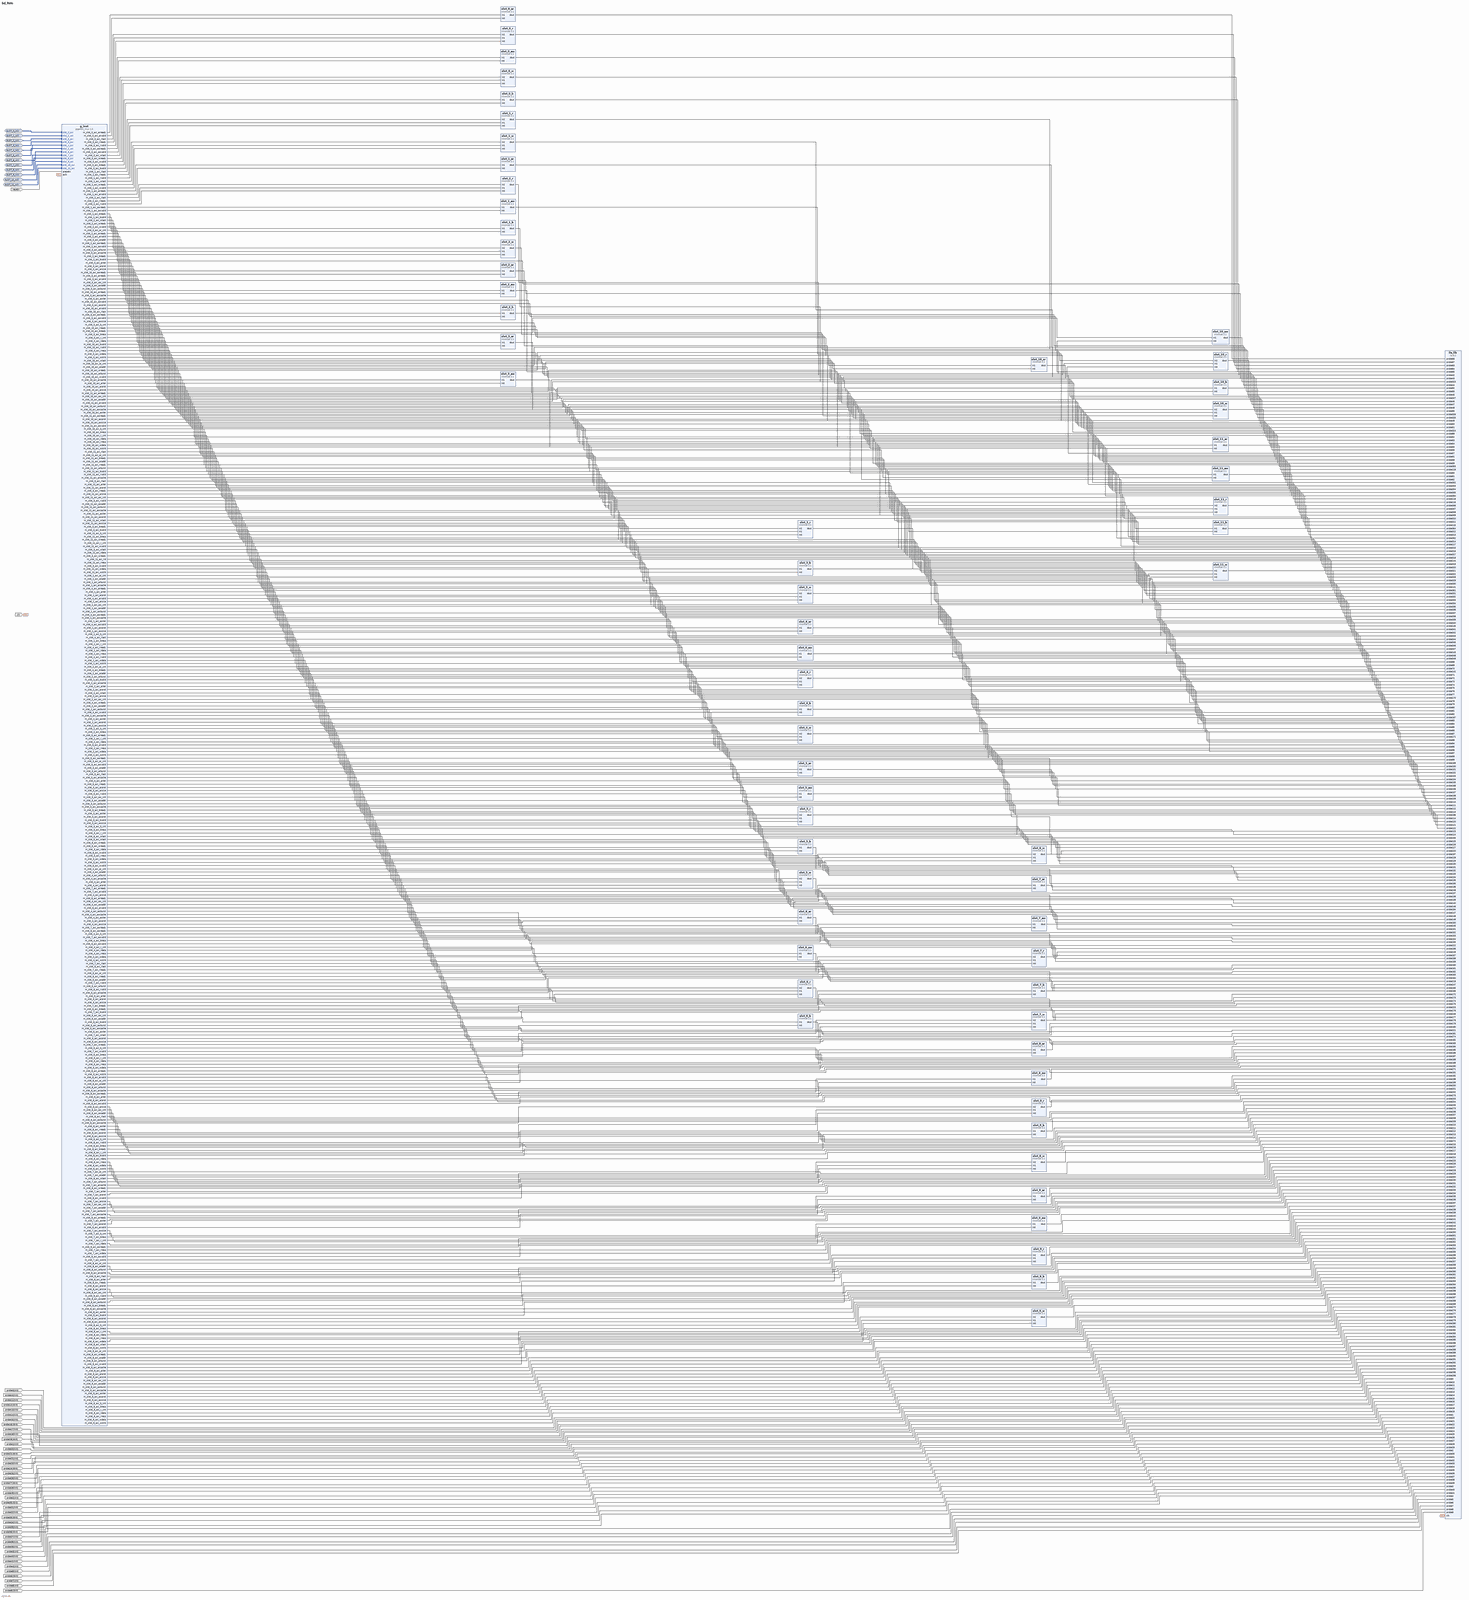
[diagram p0: block diagram of the top level, whole]
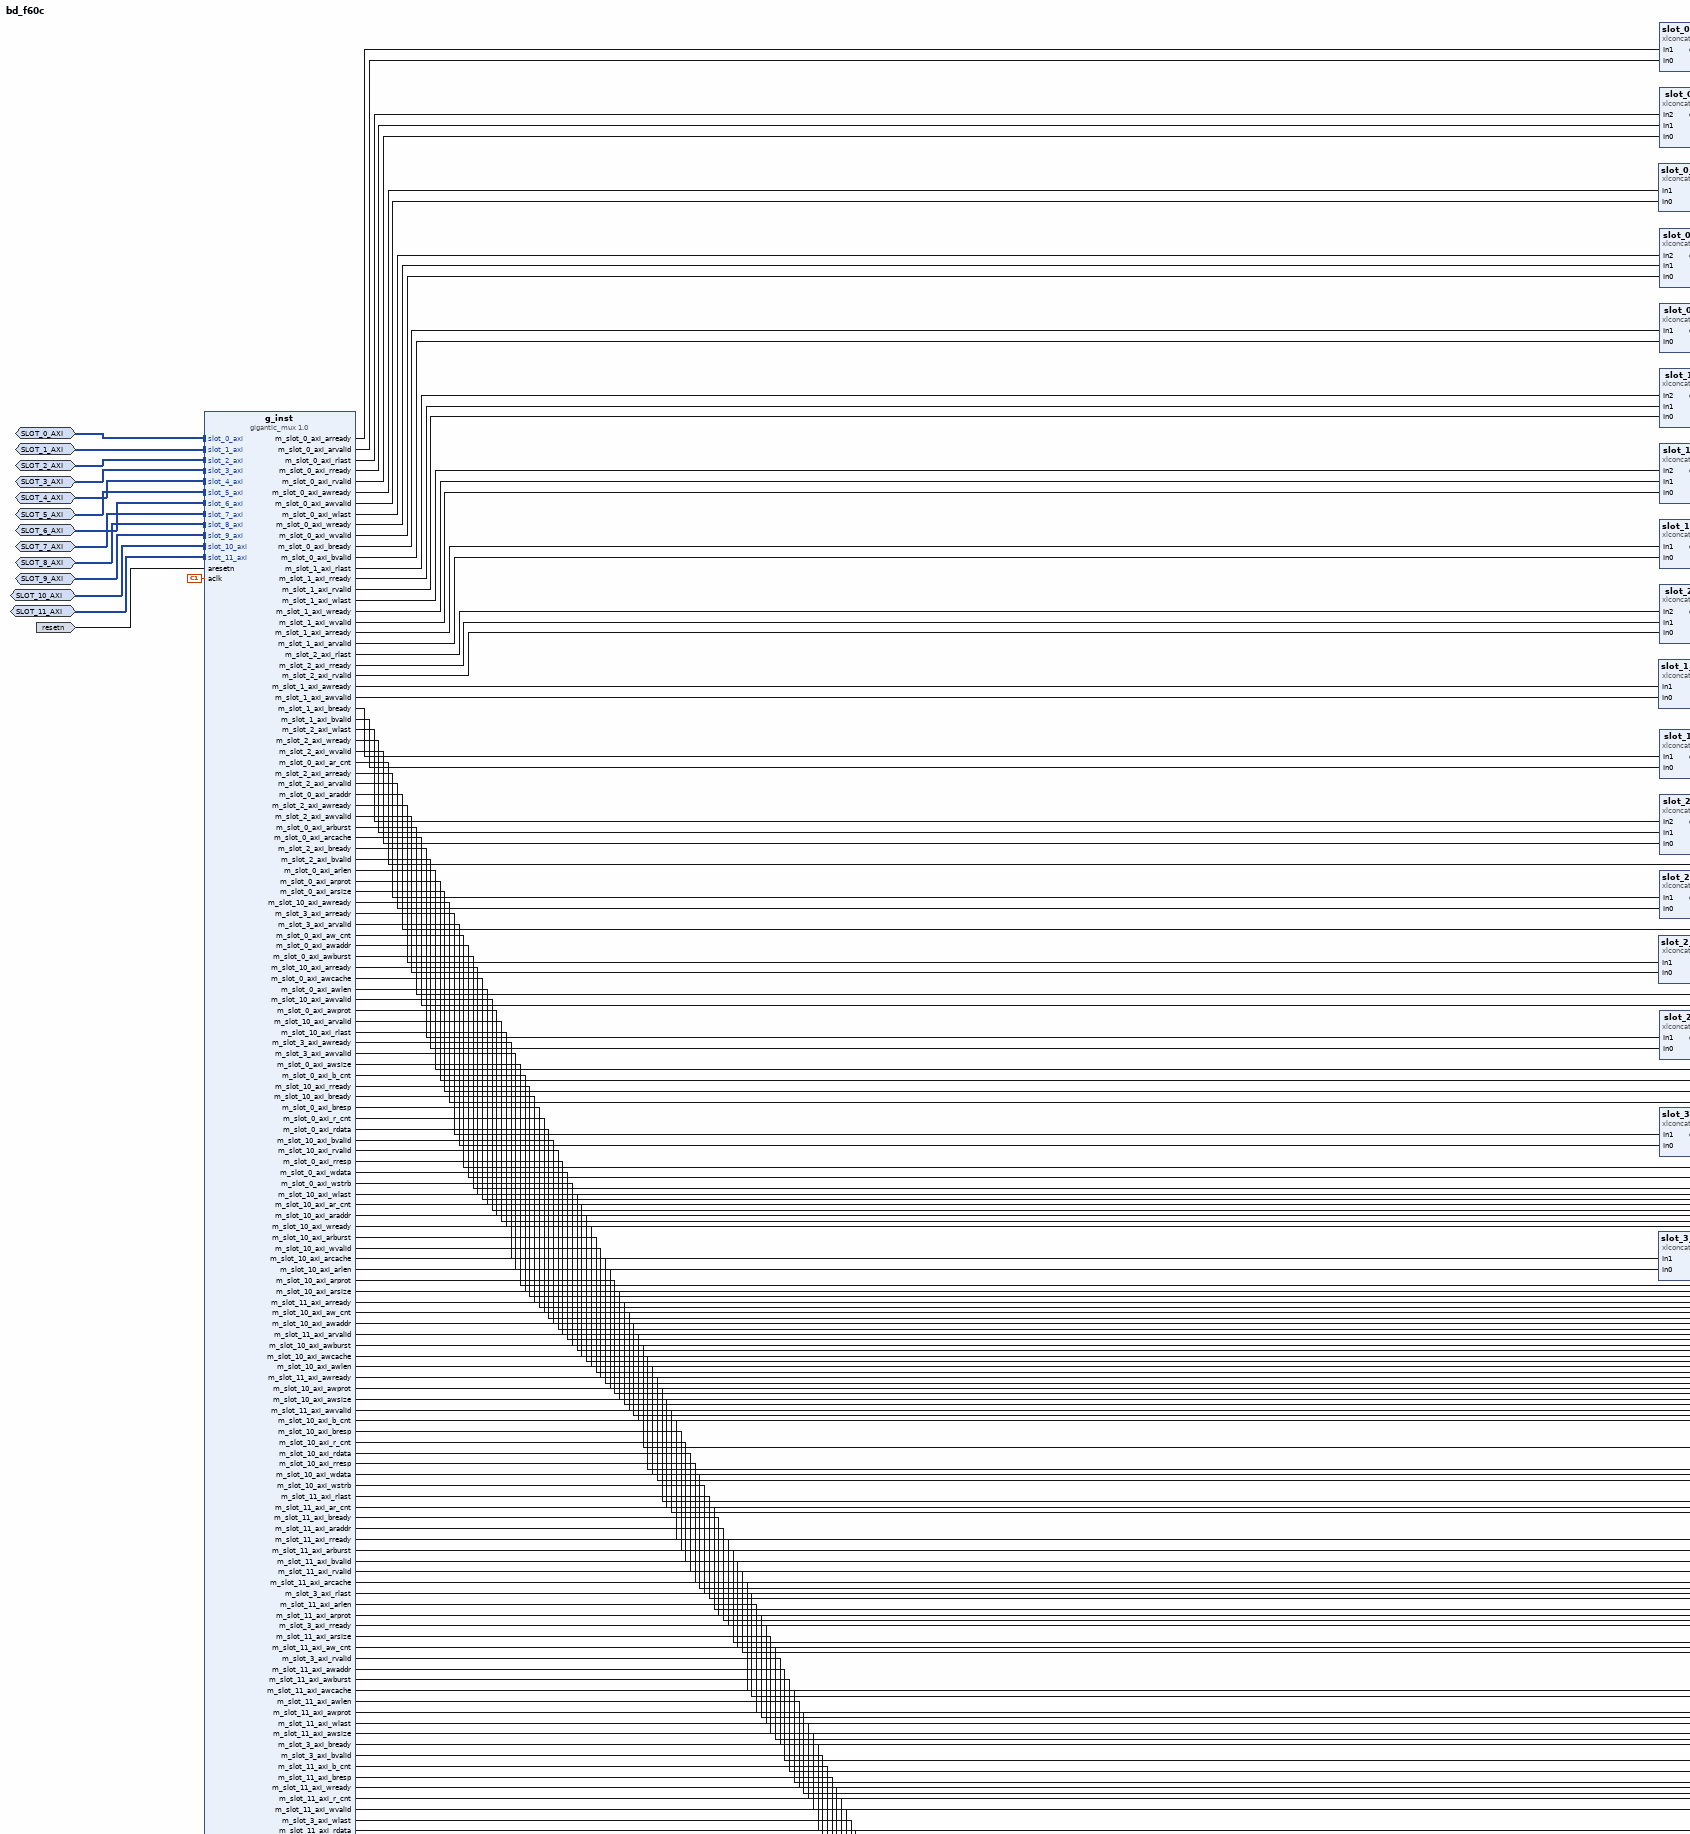
[diagram p1: block diagram of the top level, upper left part]
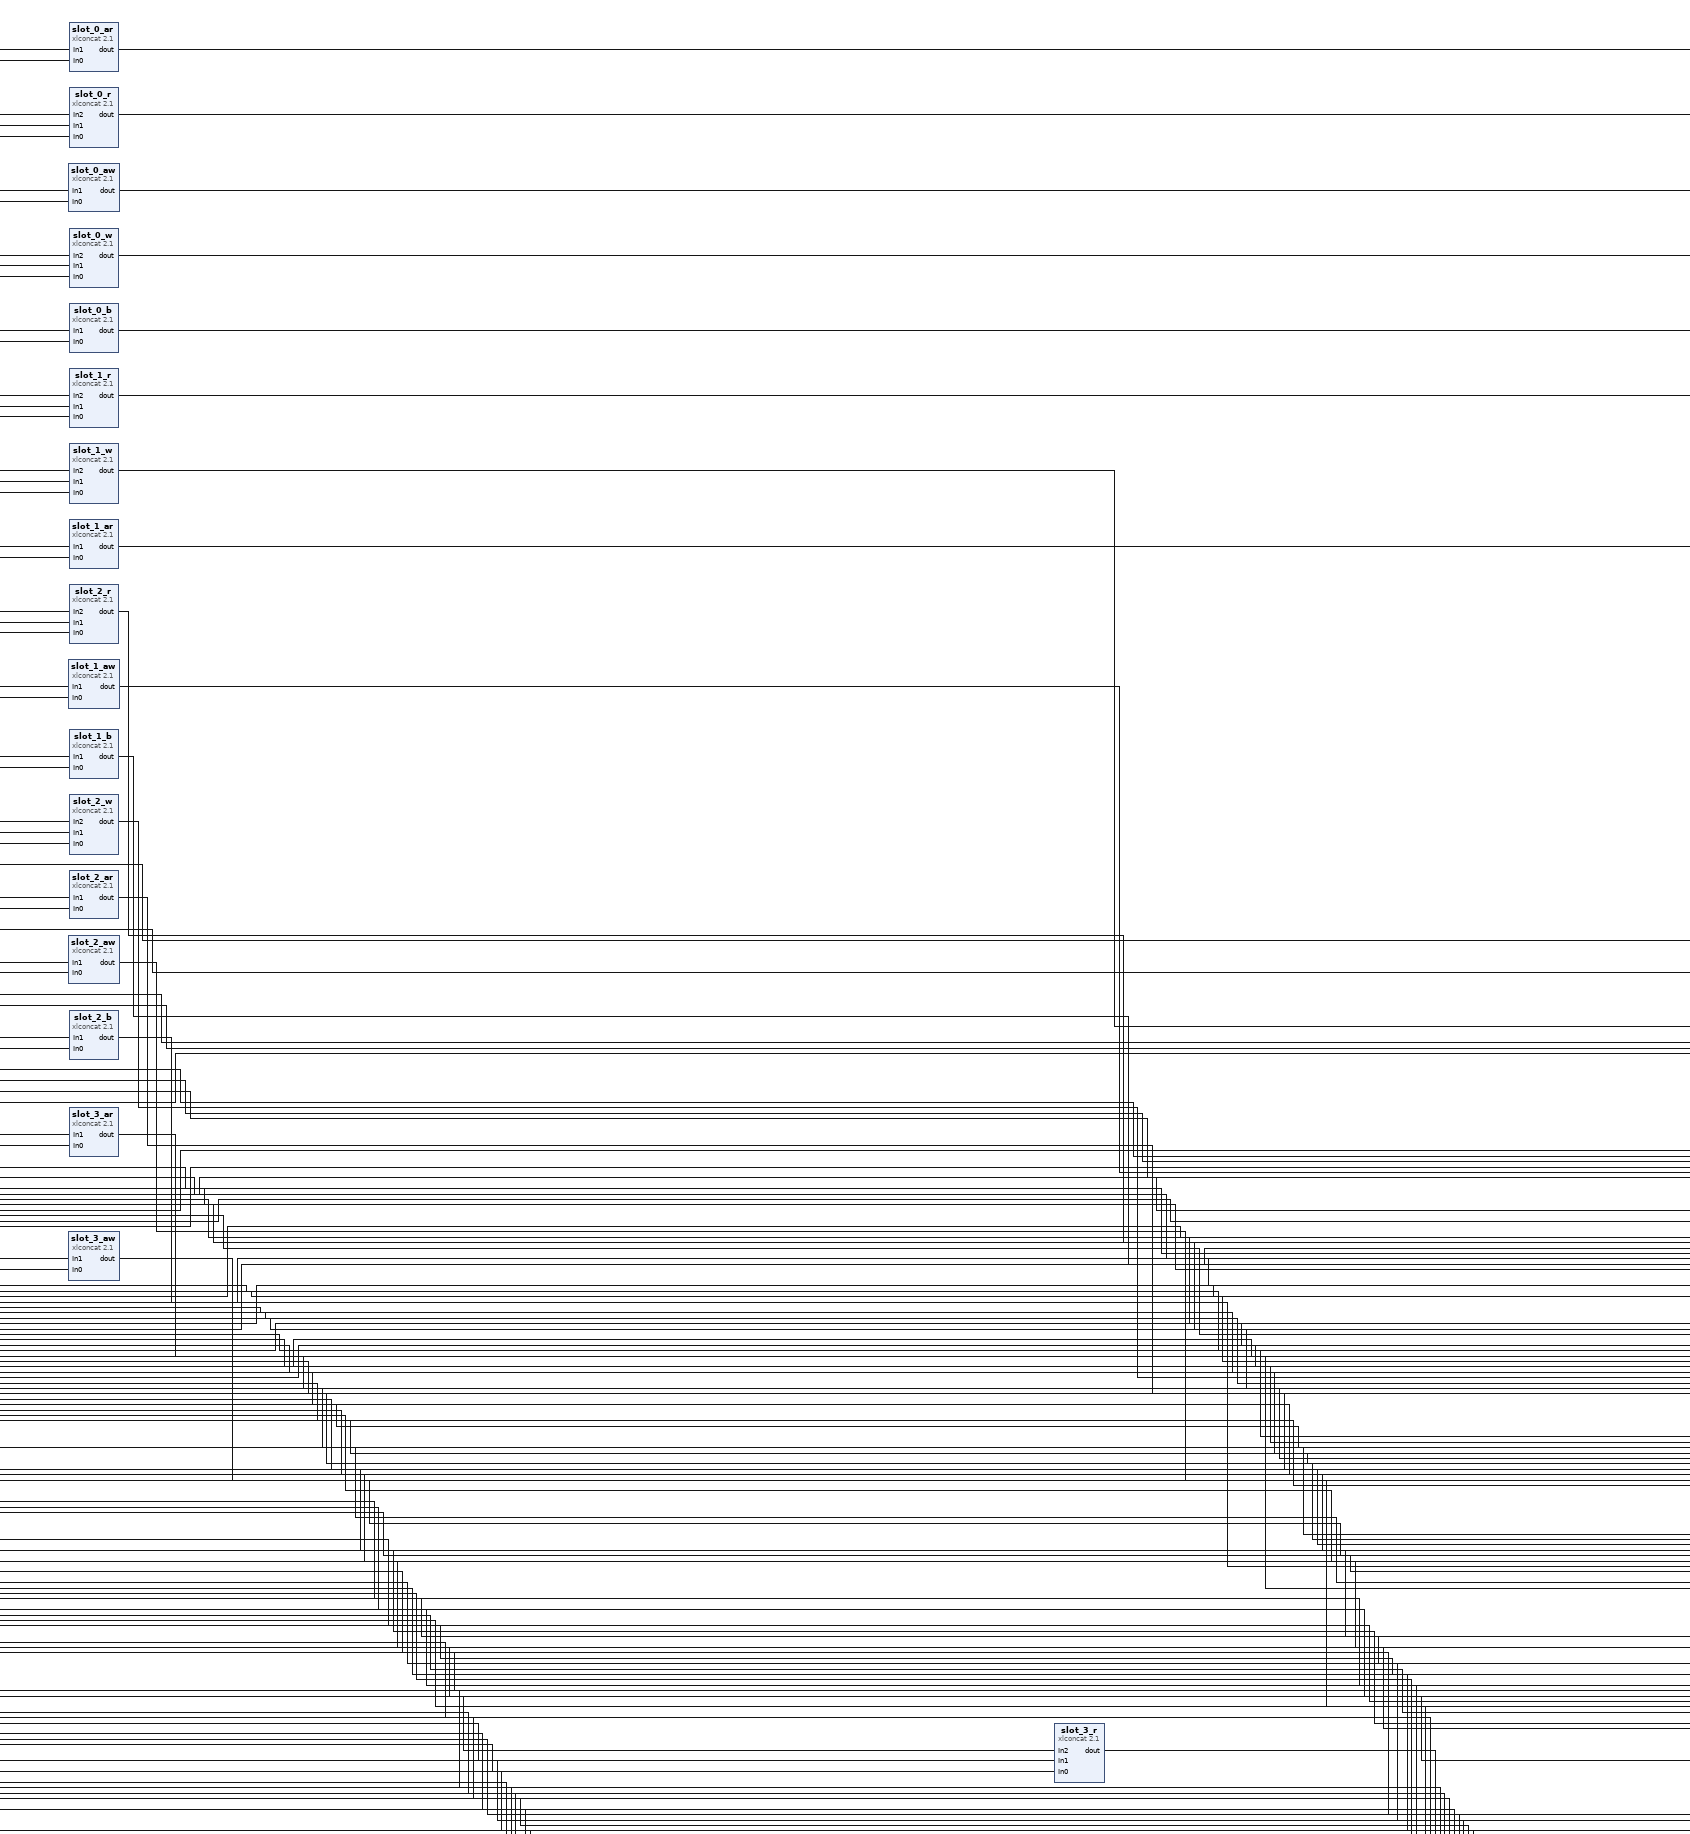
[diagram p2: block diagram of the top level, upper centre part]
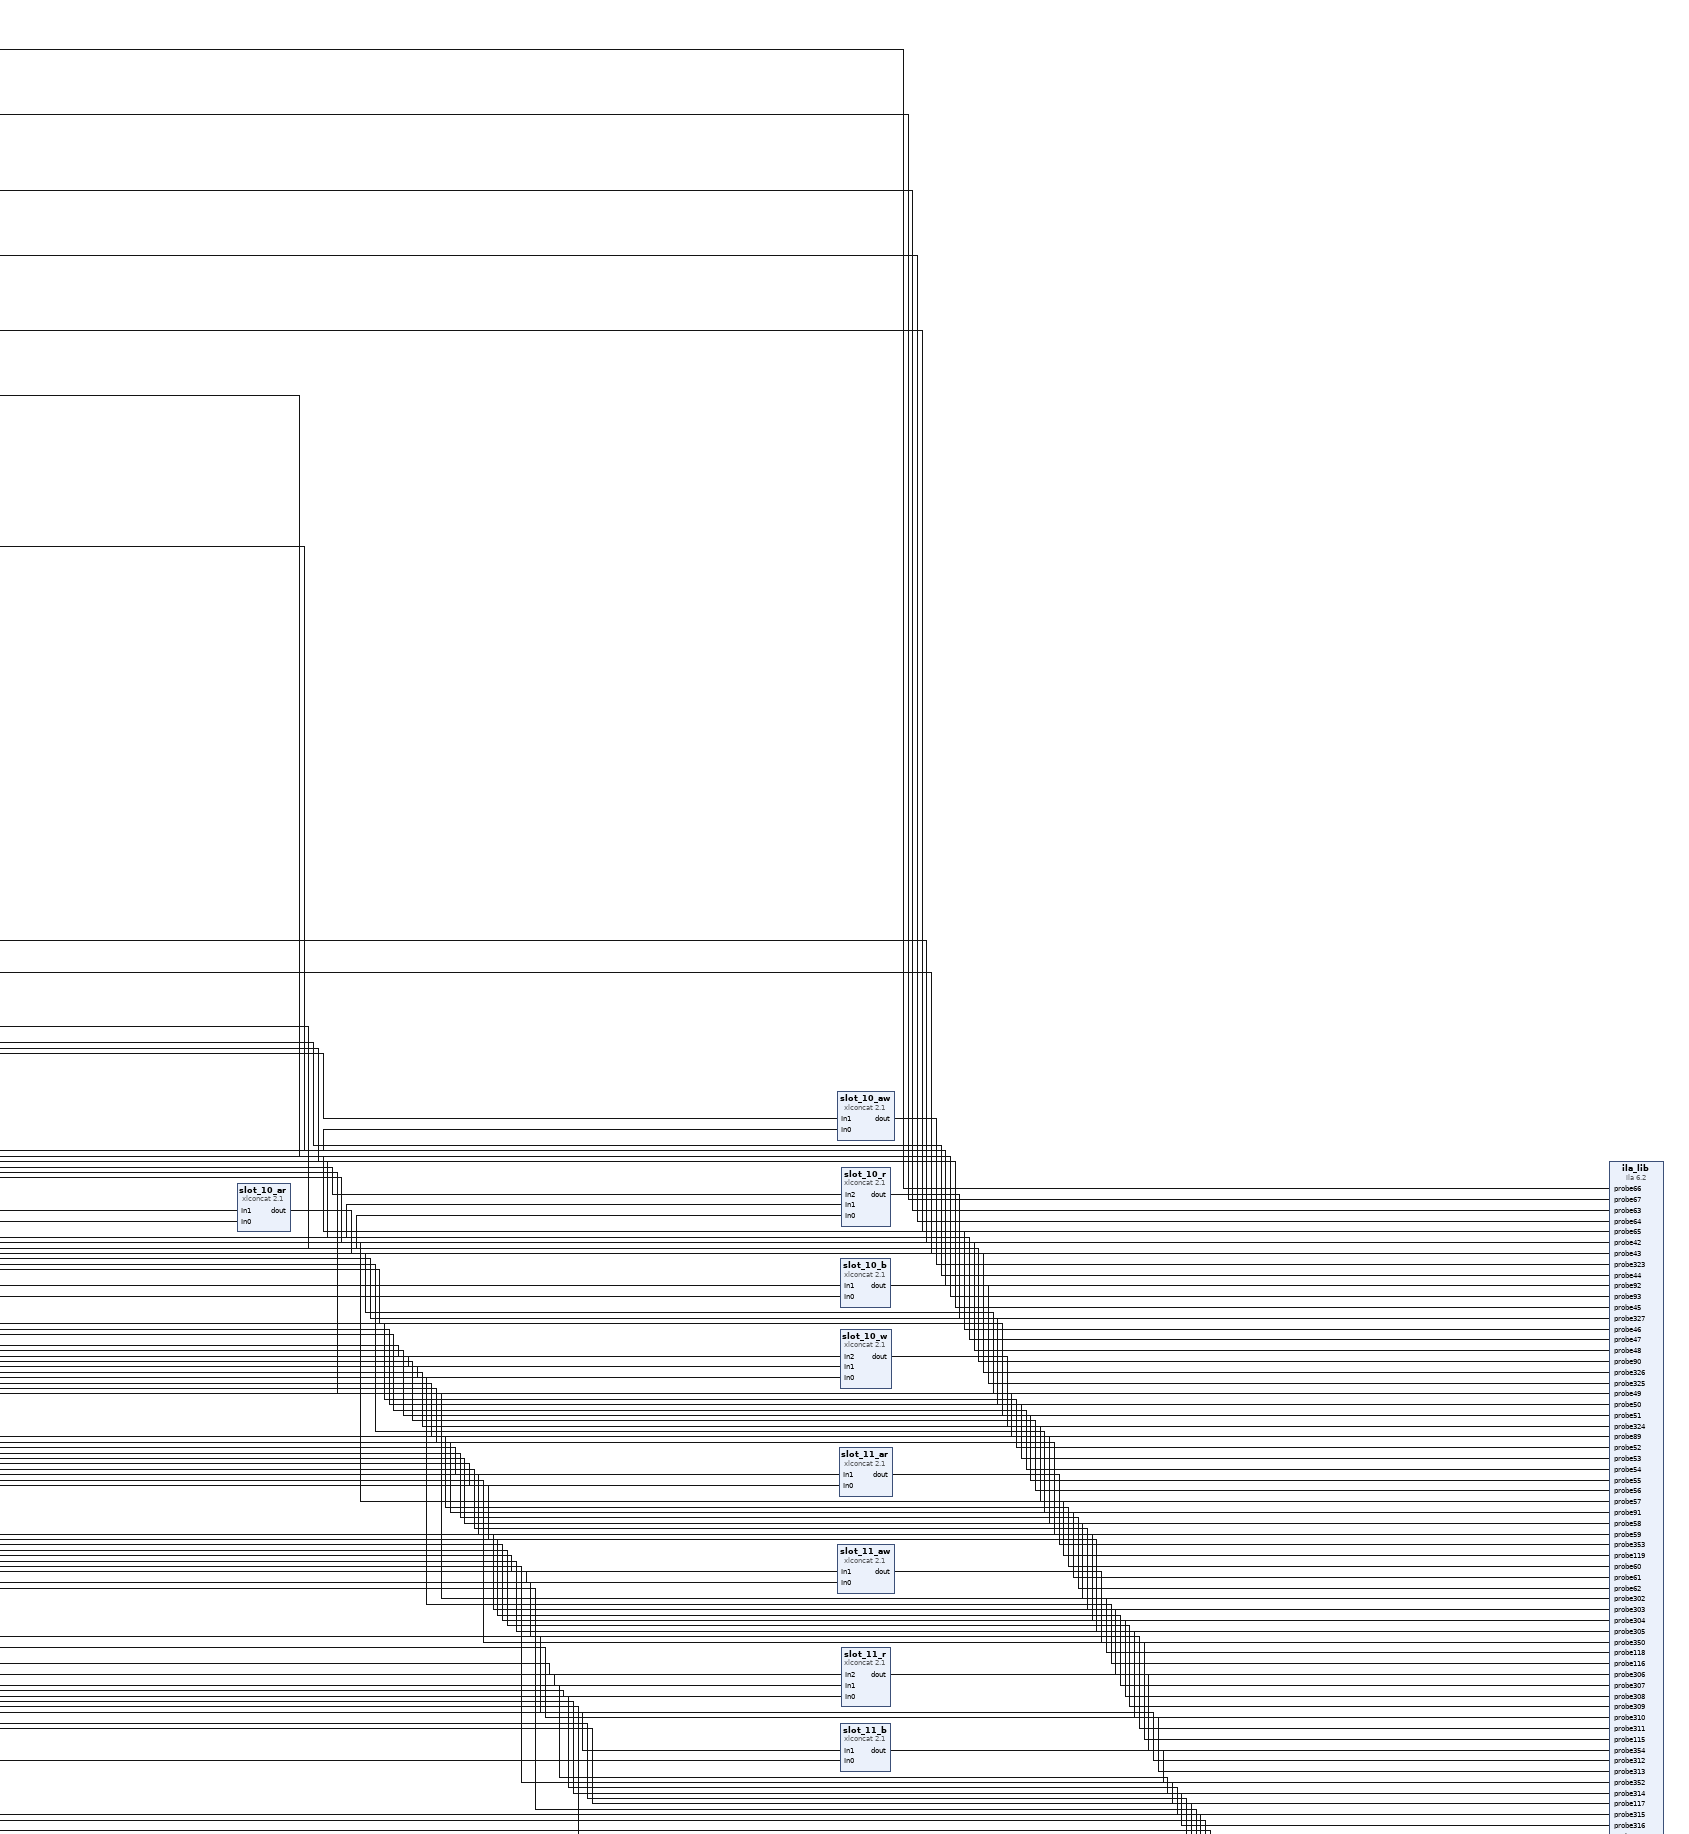
[diagram p3: block diagram of the top level, upper right part]
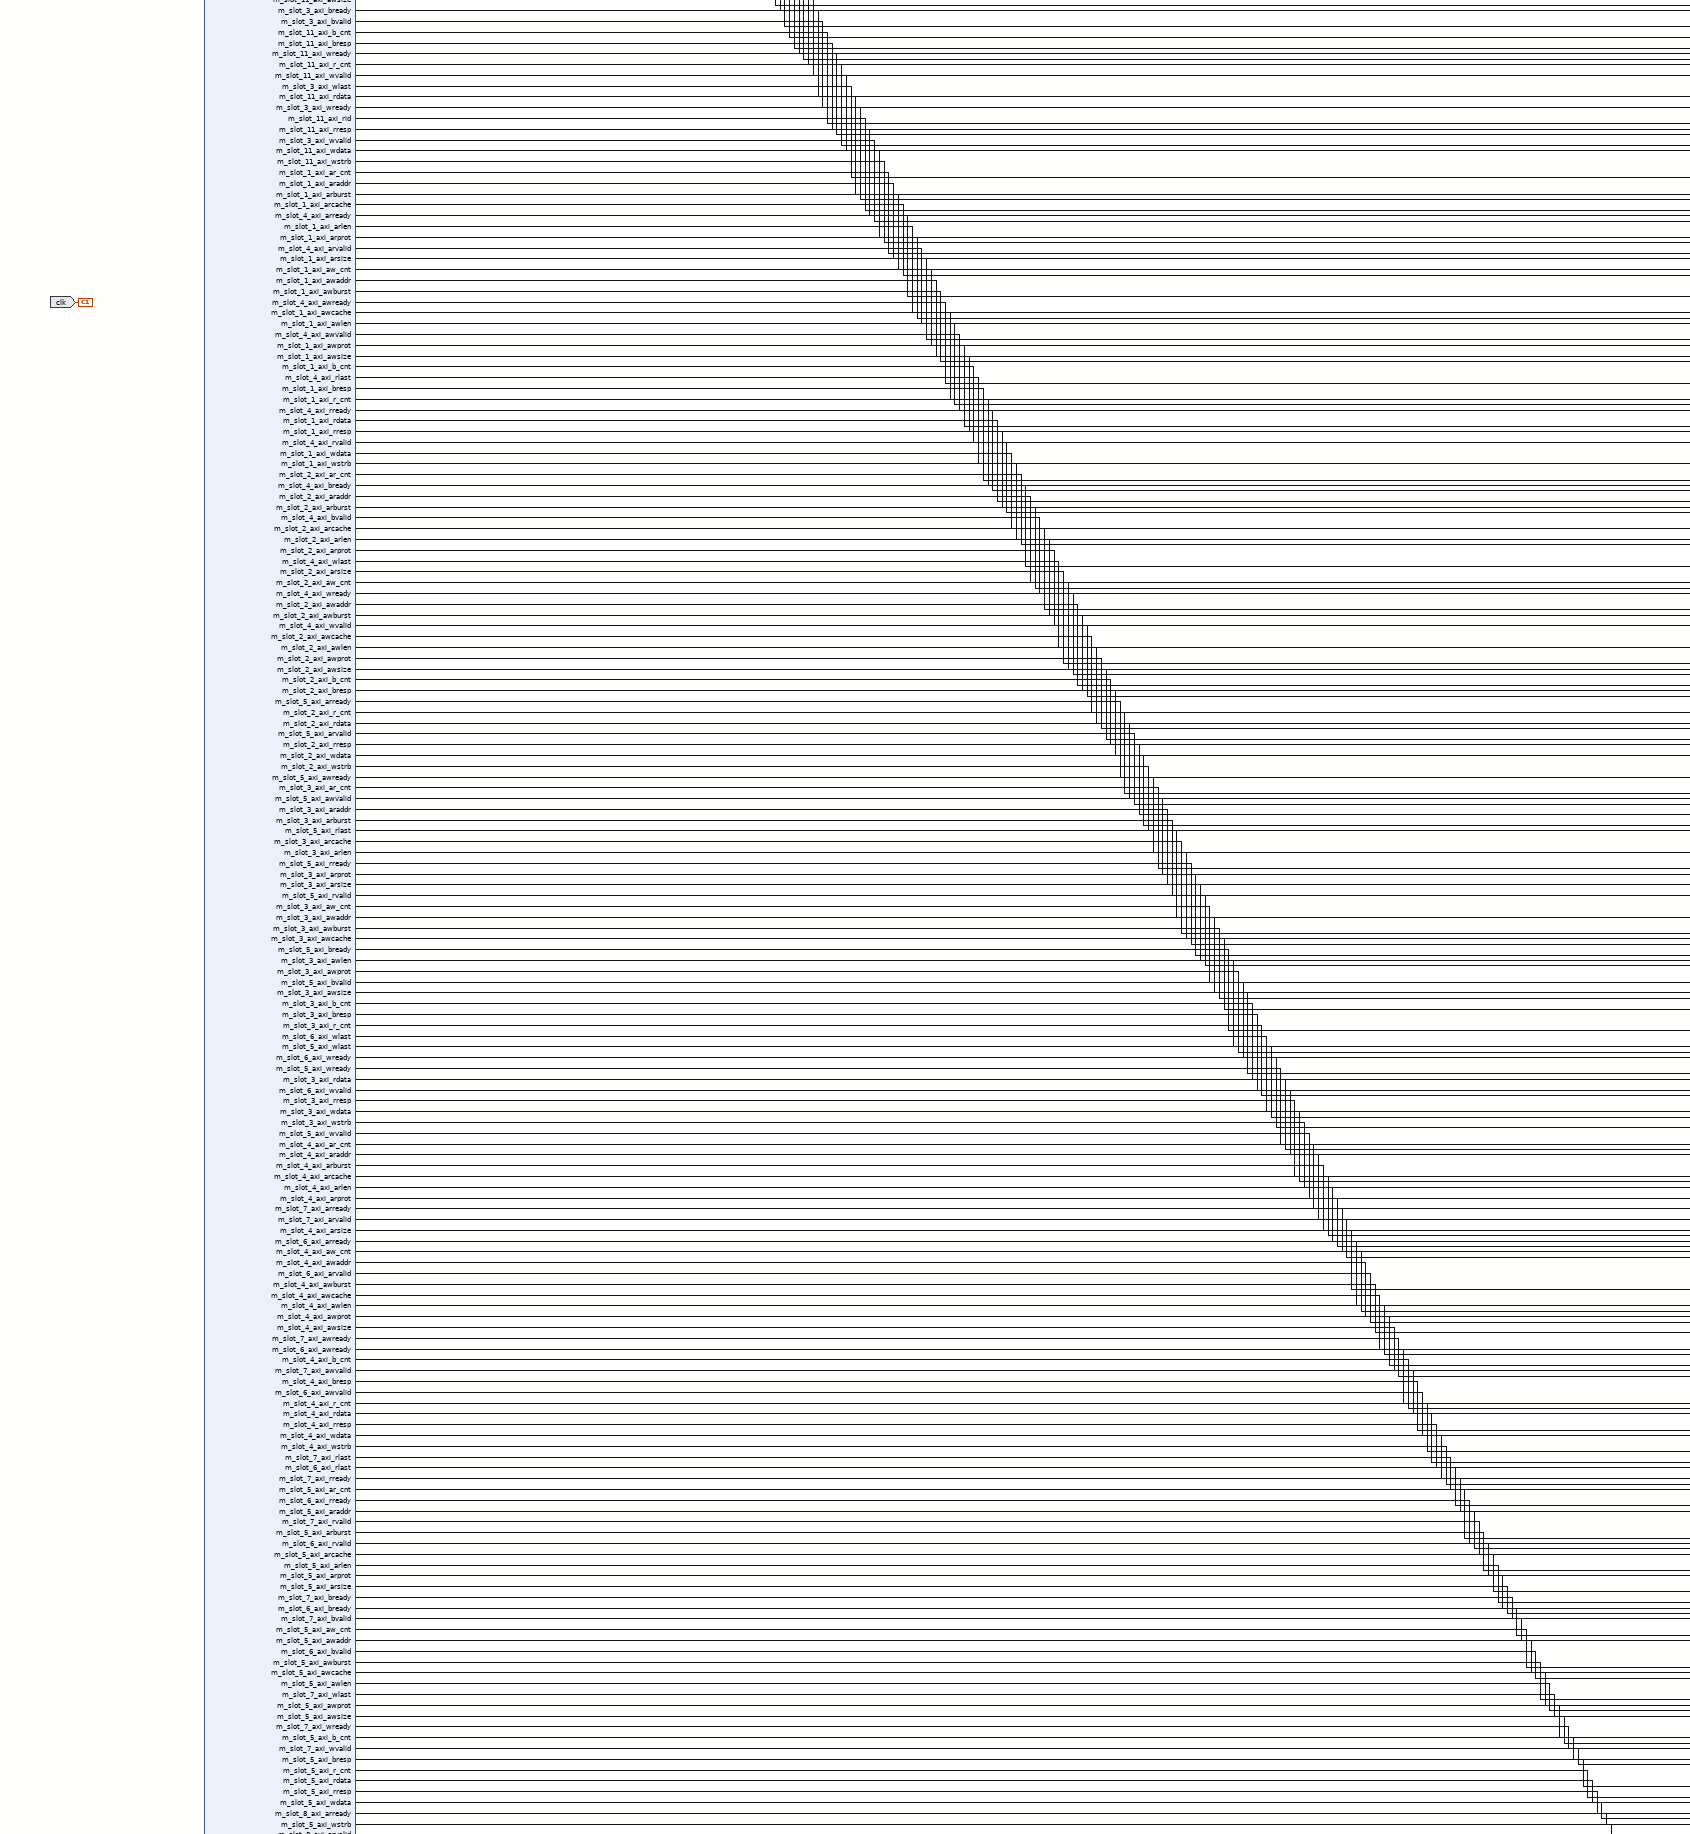
[diagram p4: block diagram of the top level, middle left part]
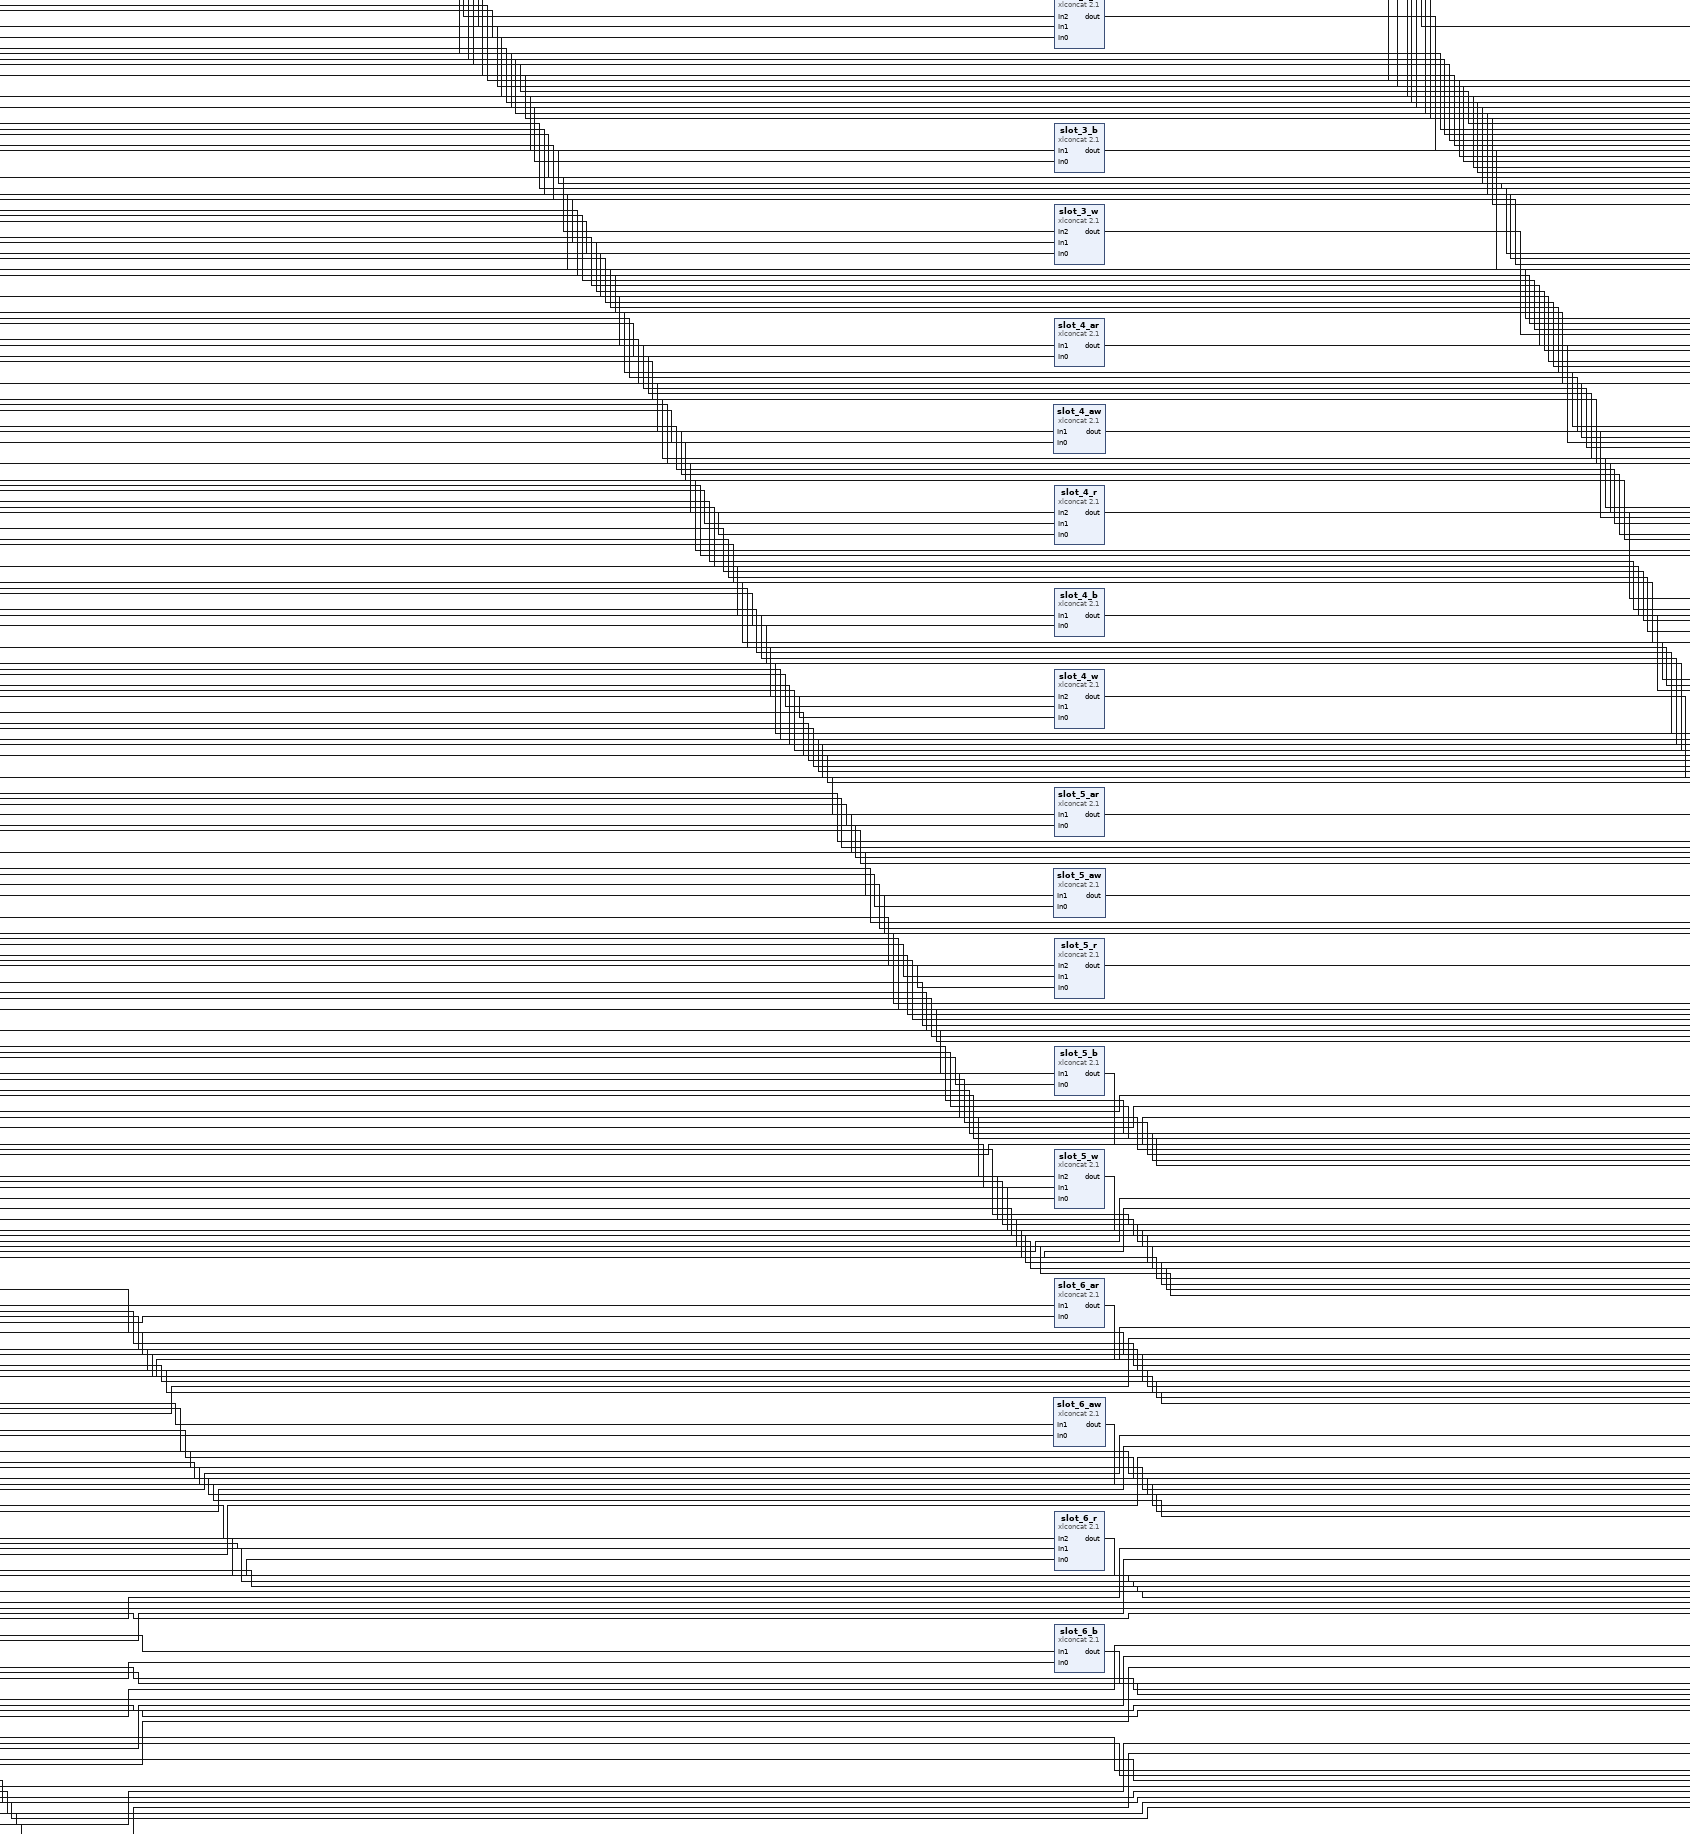
[diagram p5: block diagram of the top level, middle centre part]
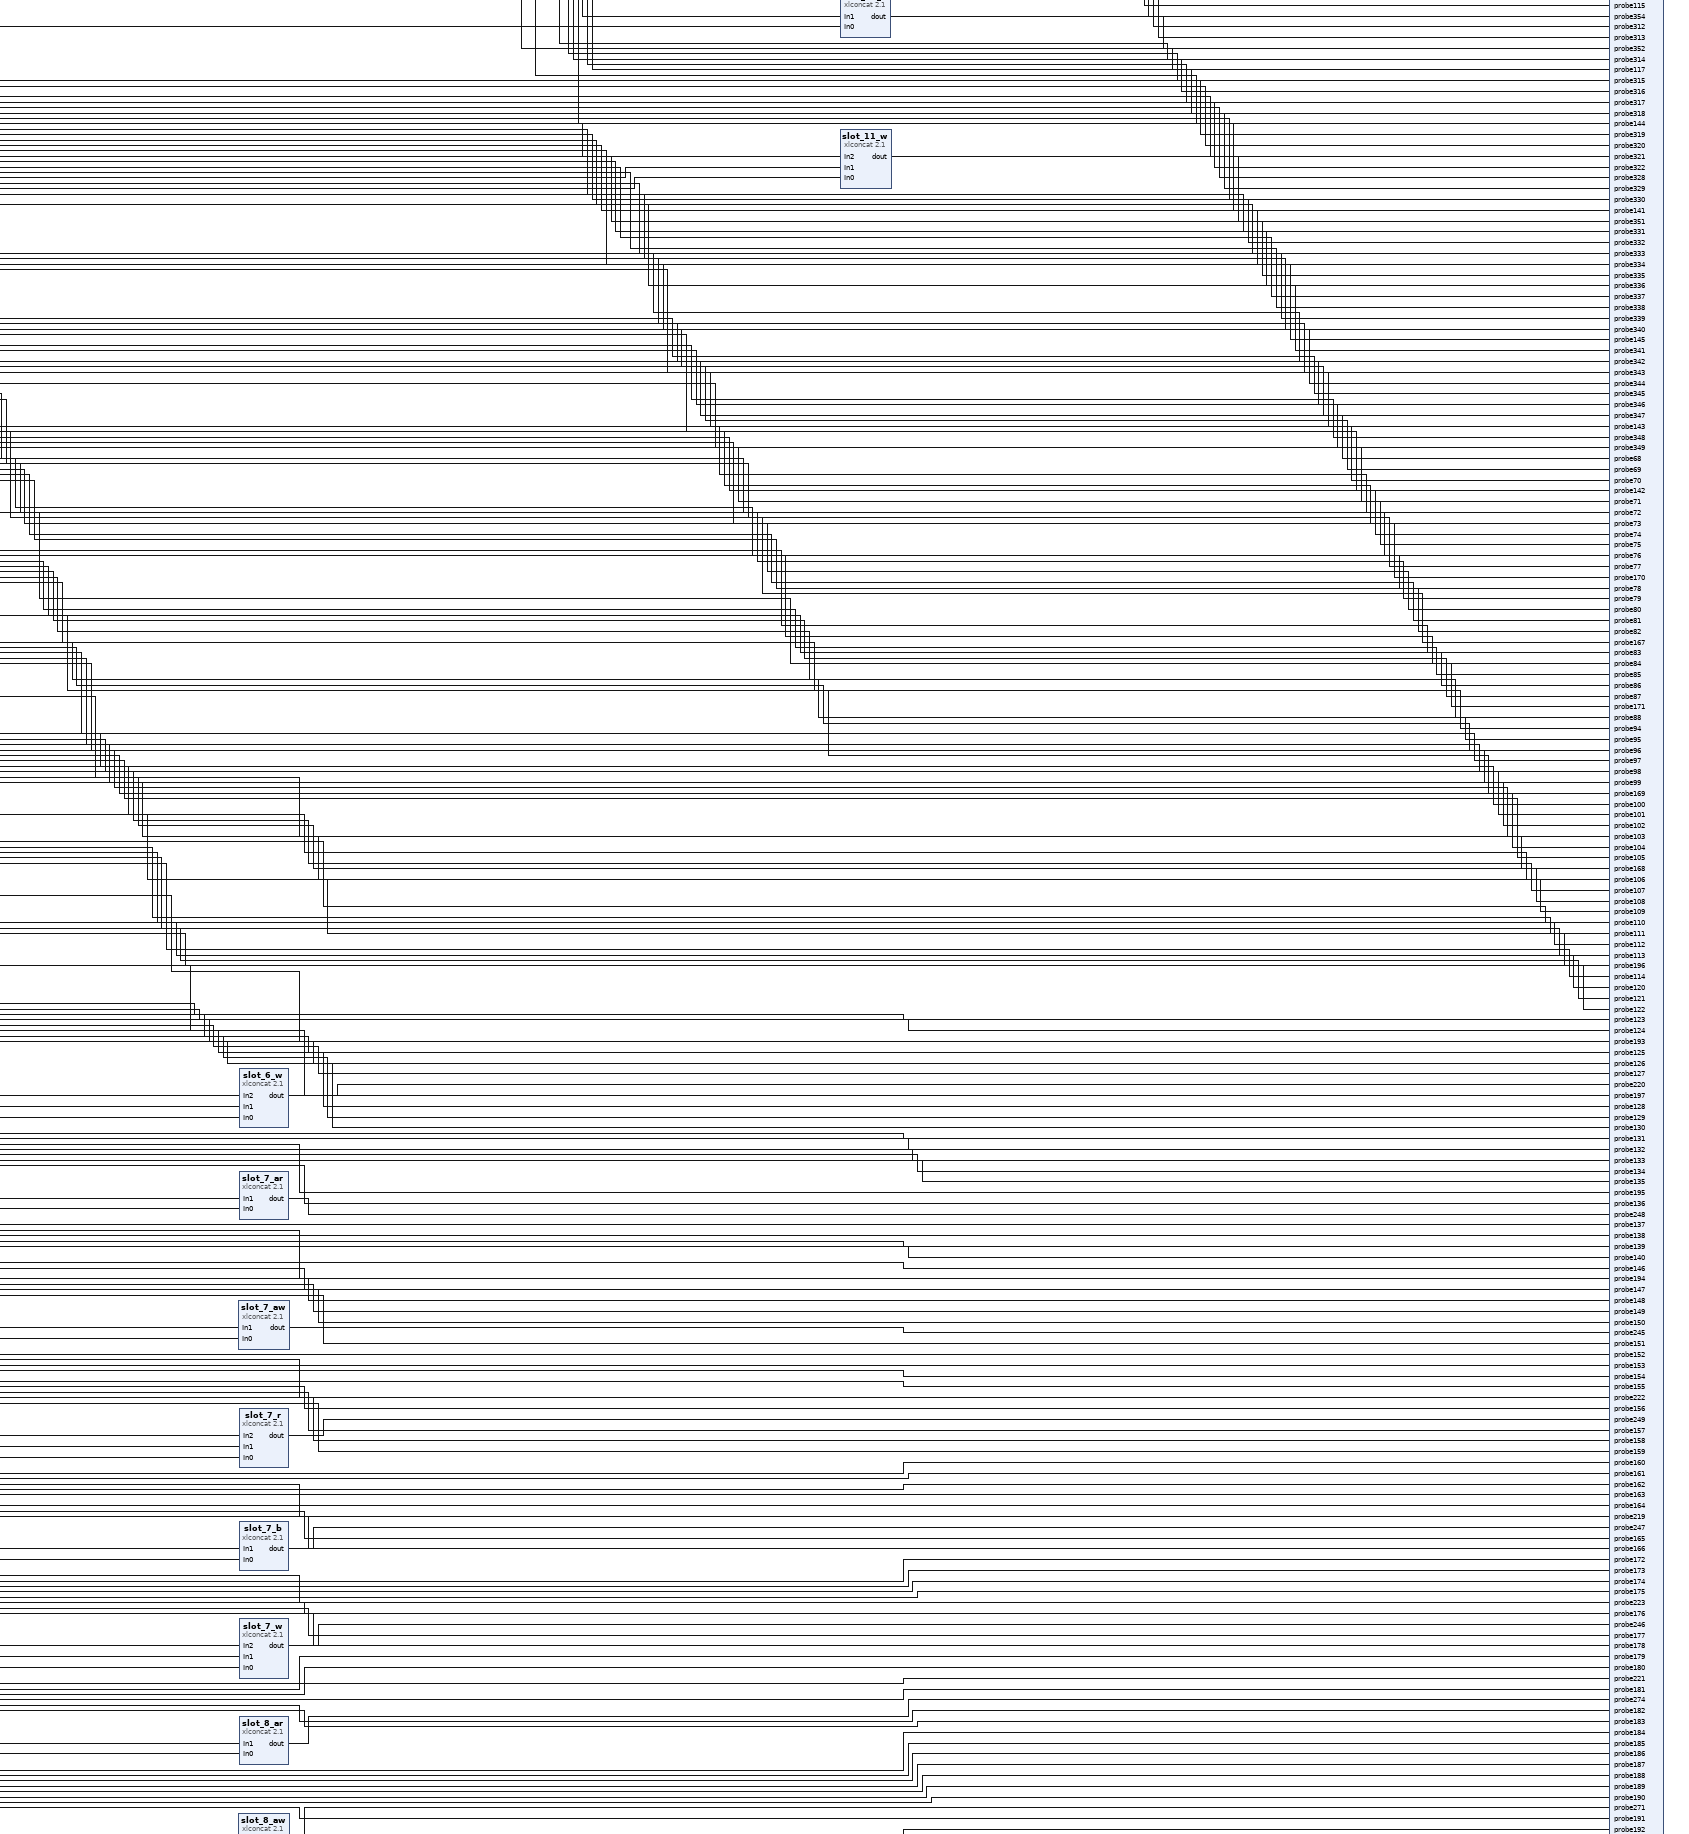
[diagram p6: block diagram of the top level, middle right part]
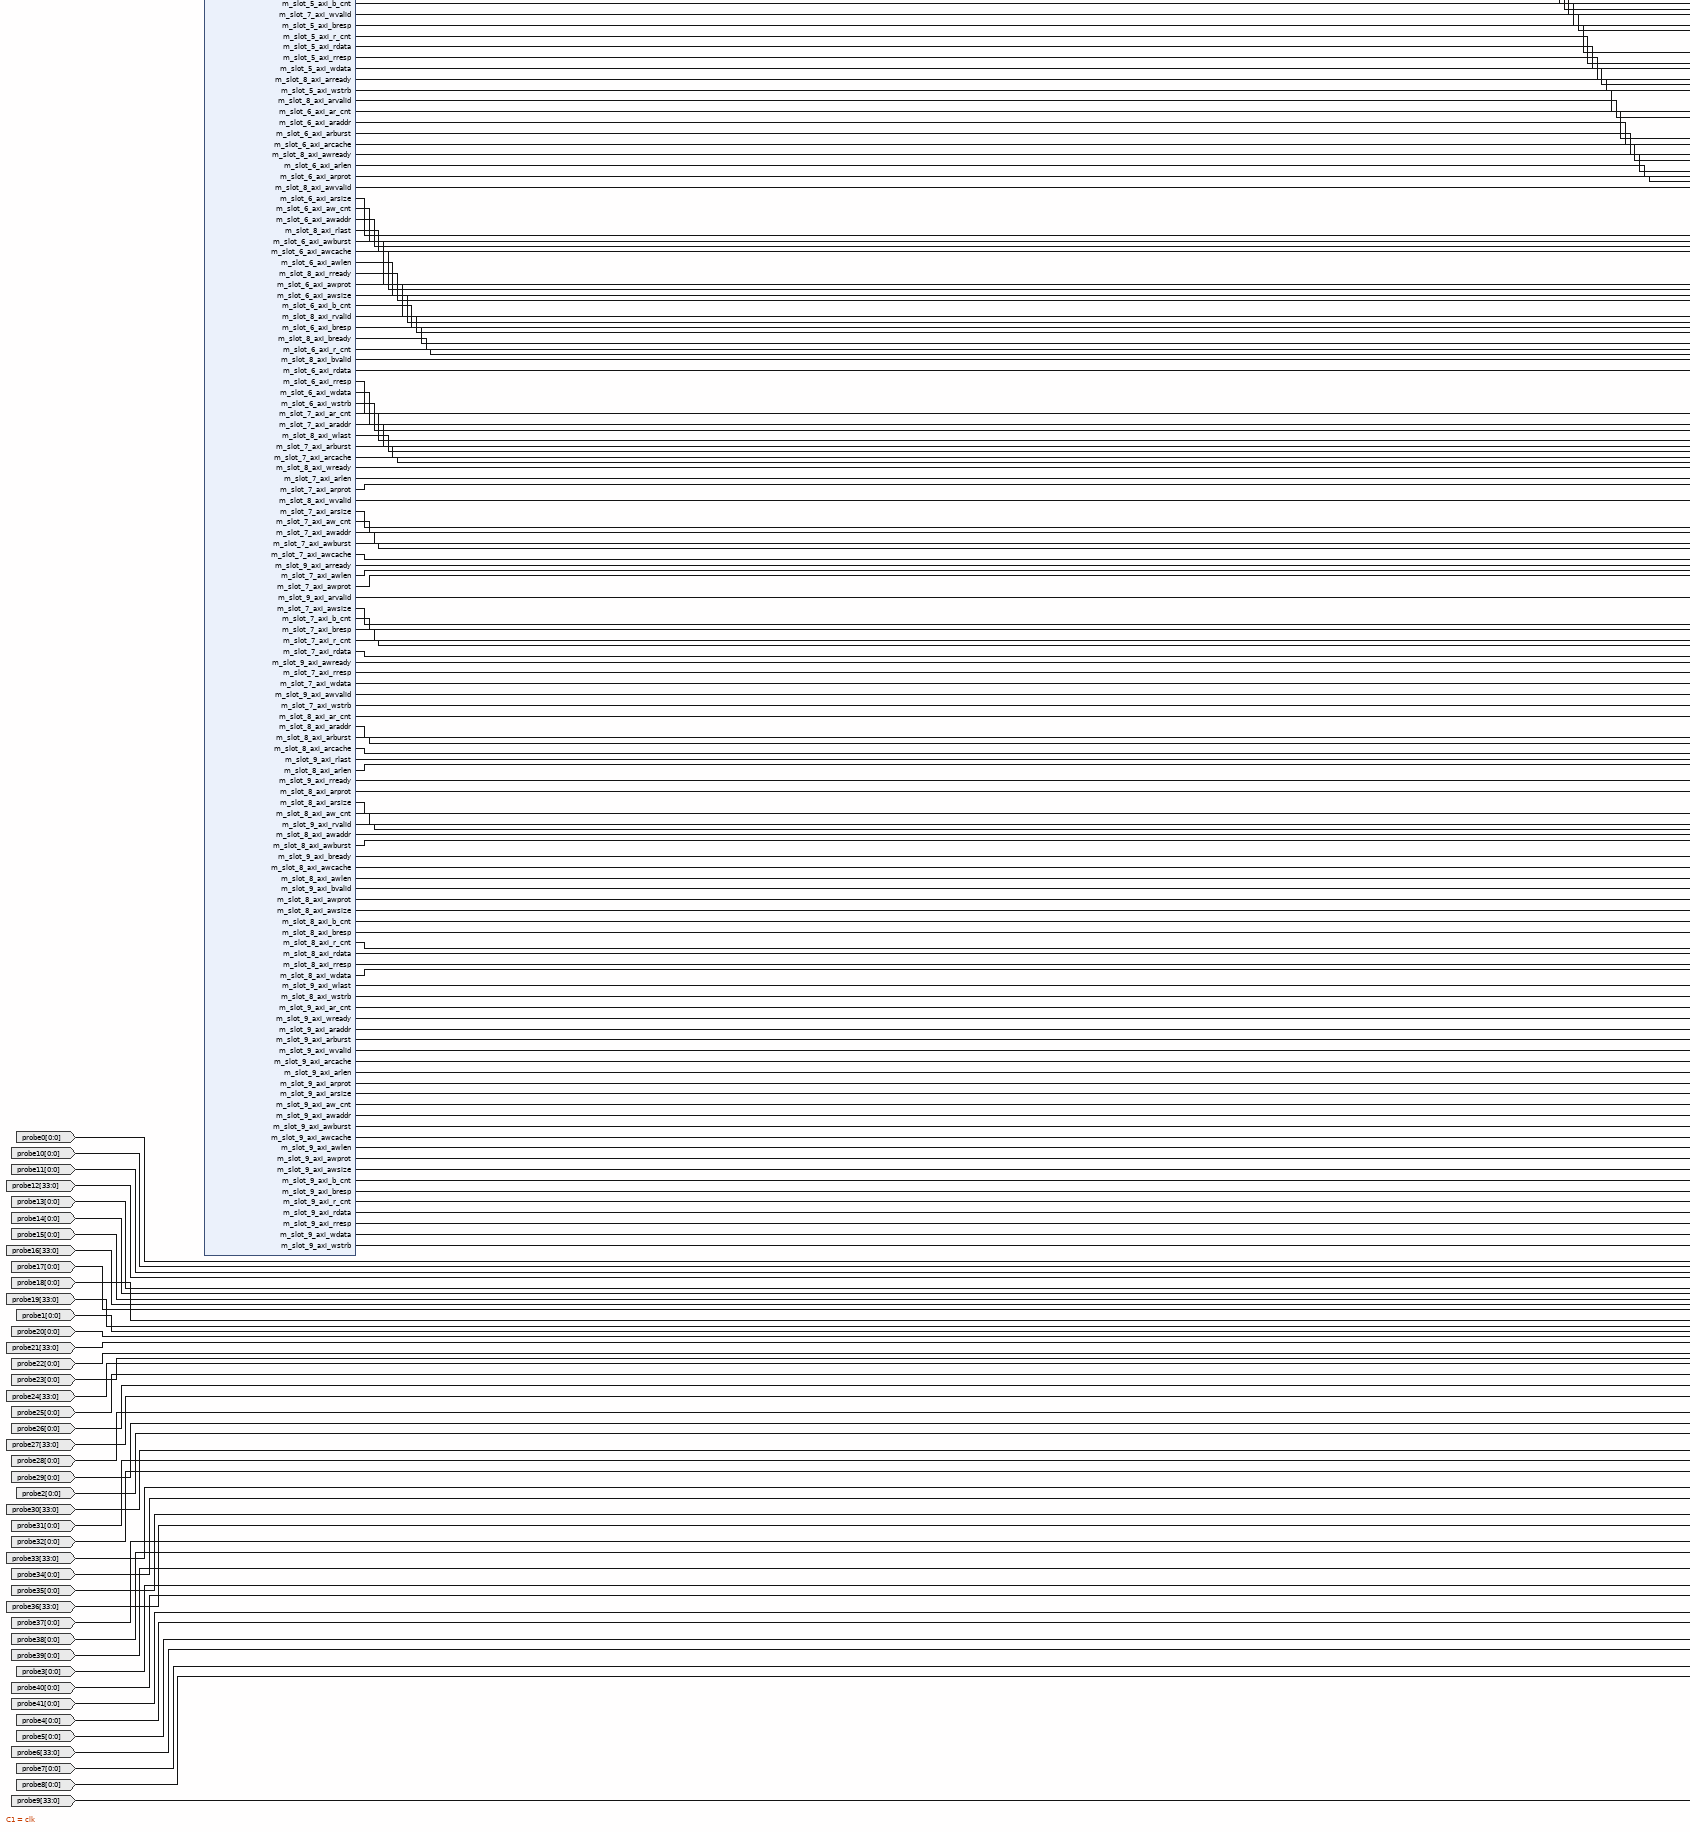
[diagram p7: block diagram of the top level, lower left part]
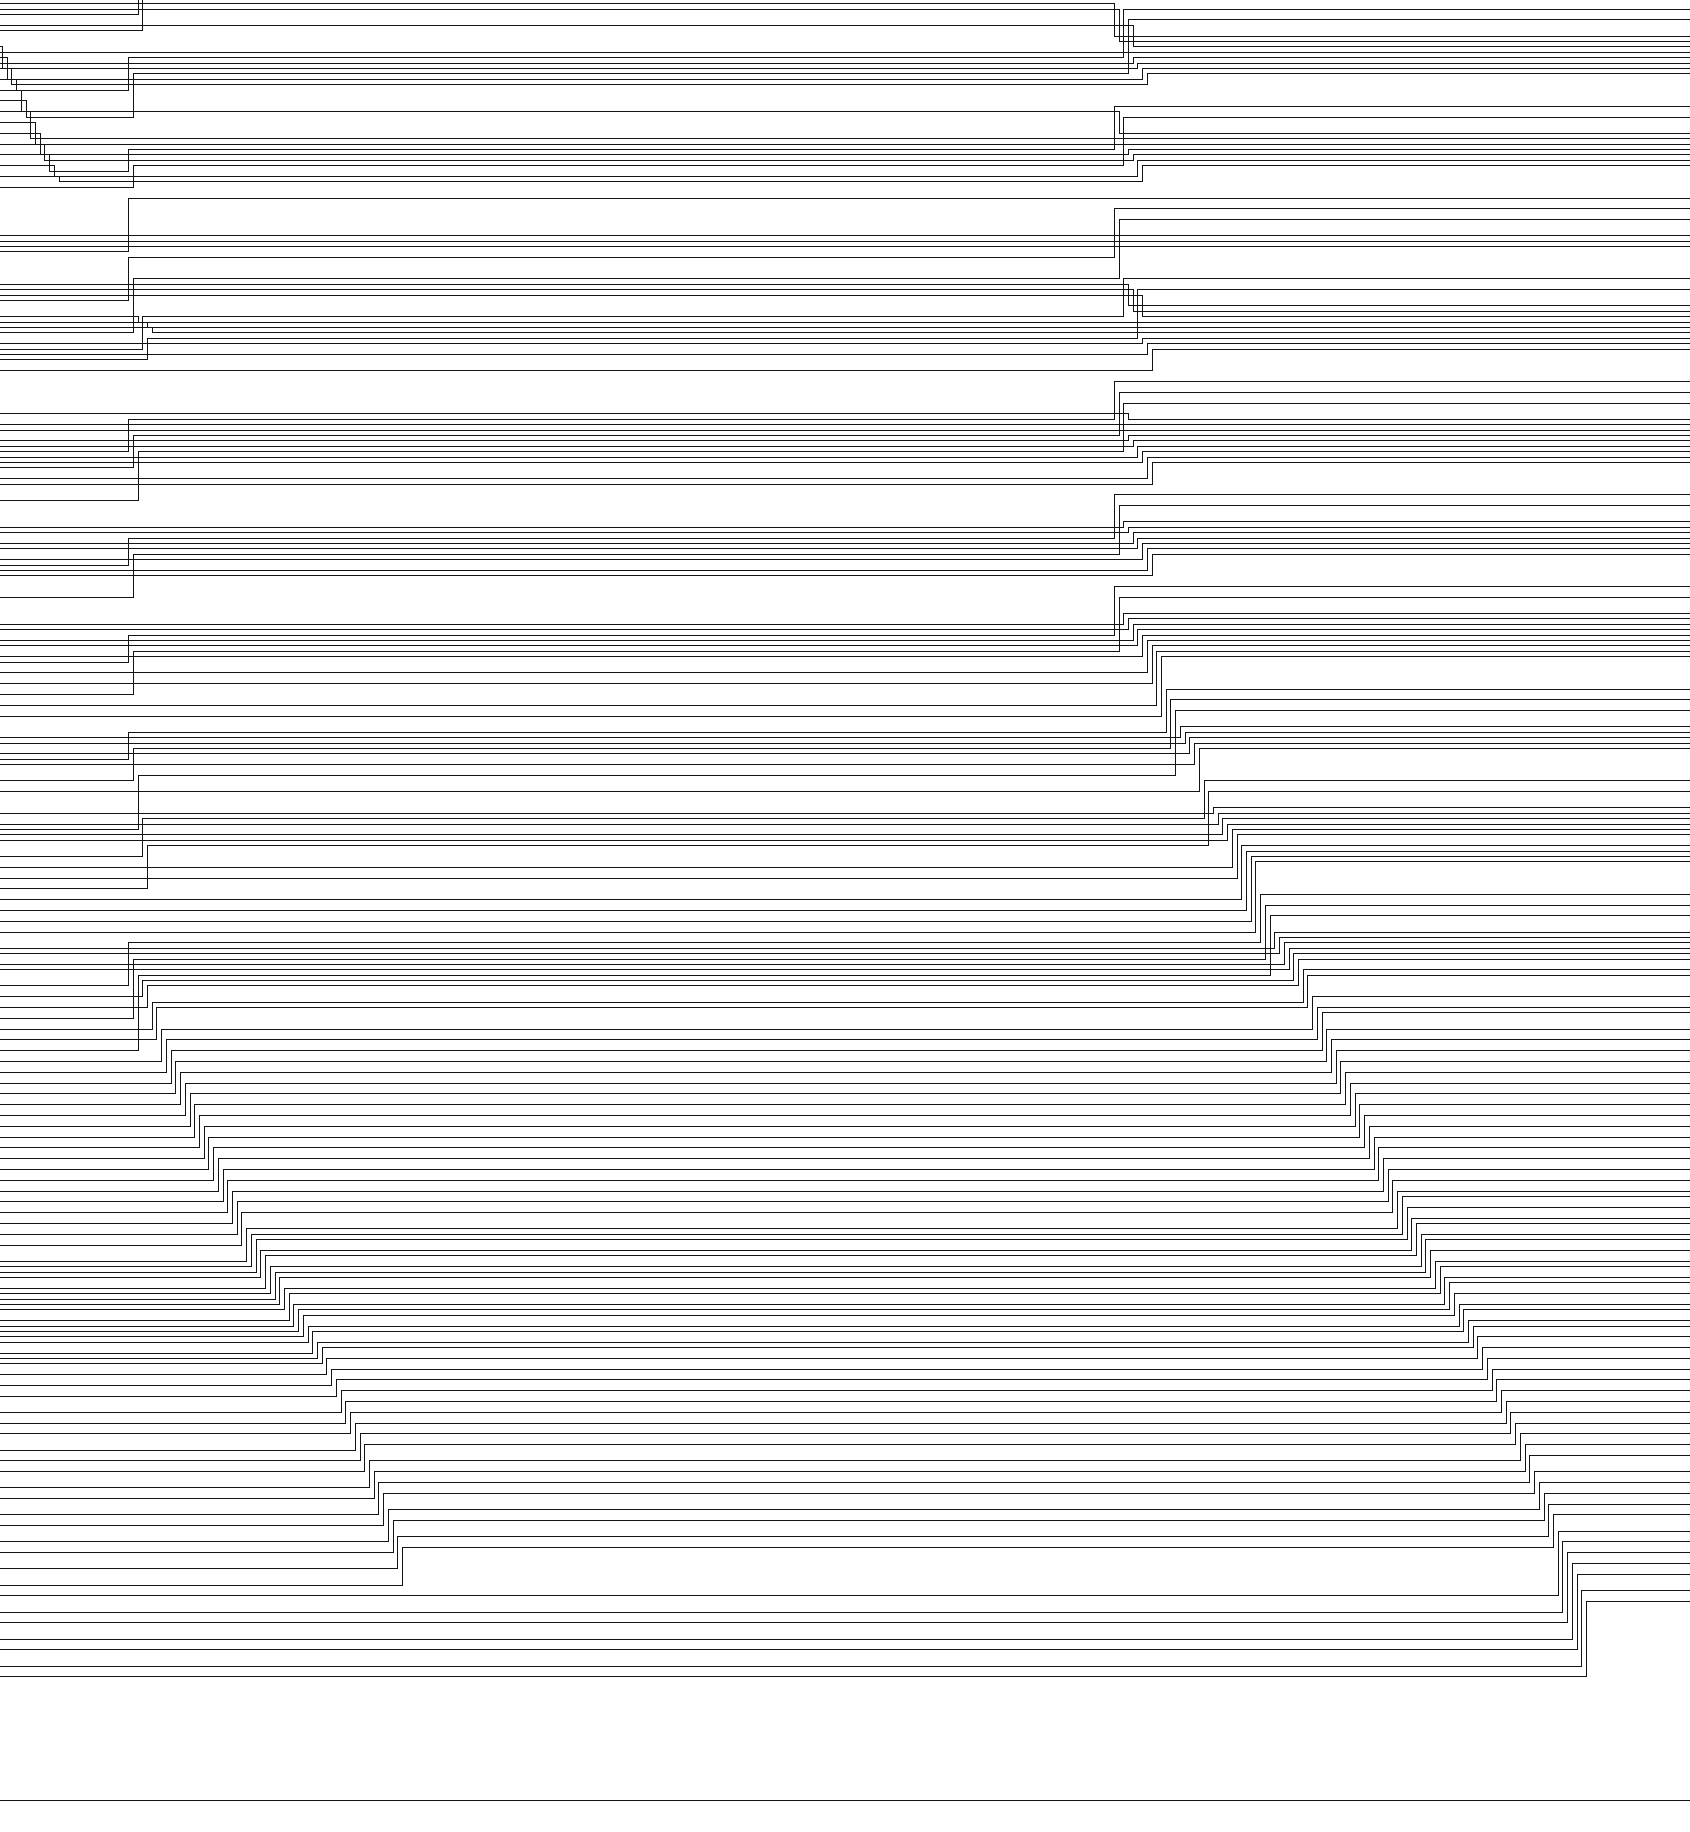
[diagram p8: block diagram of the top level, lower centre part]
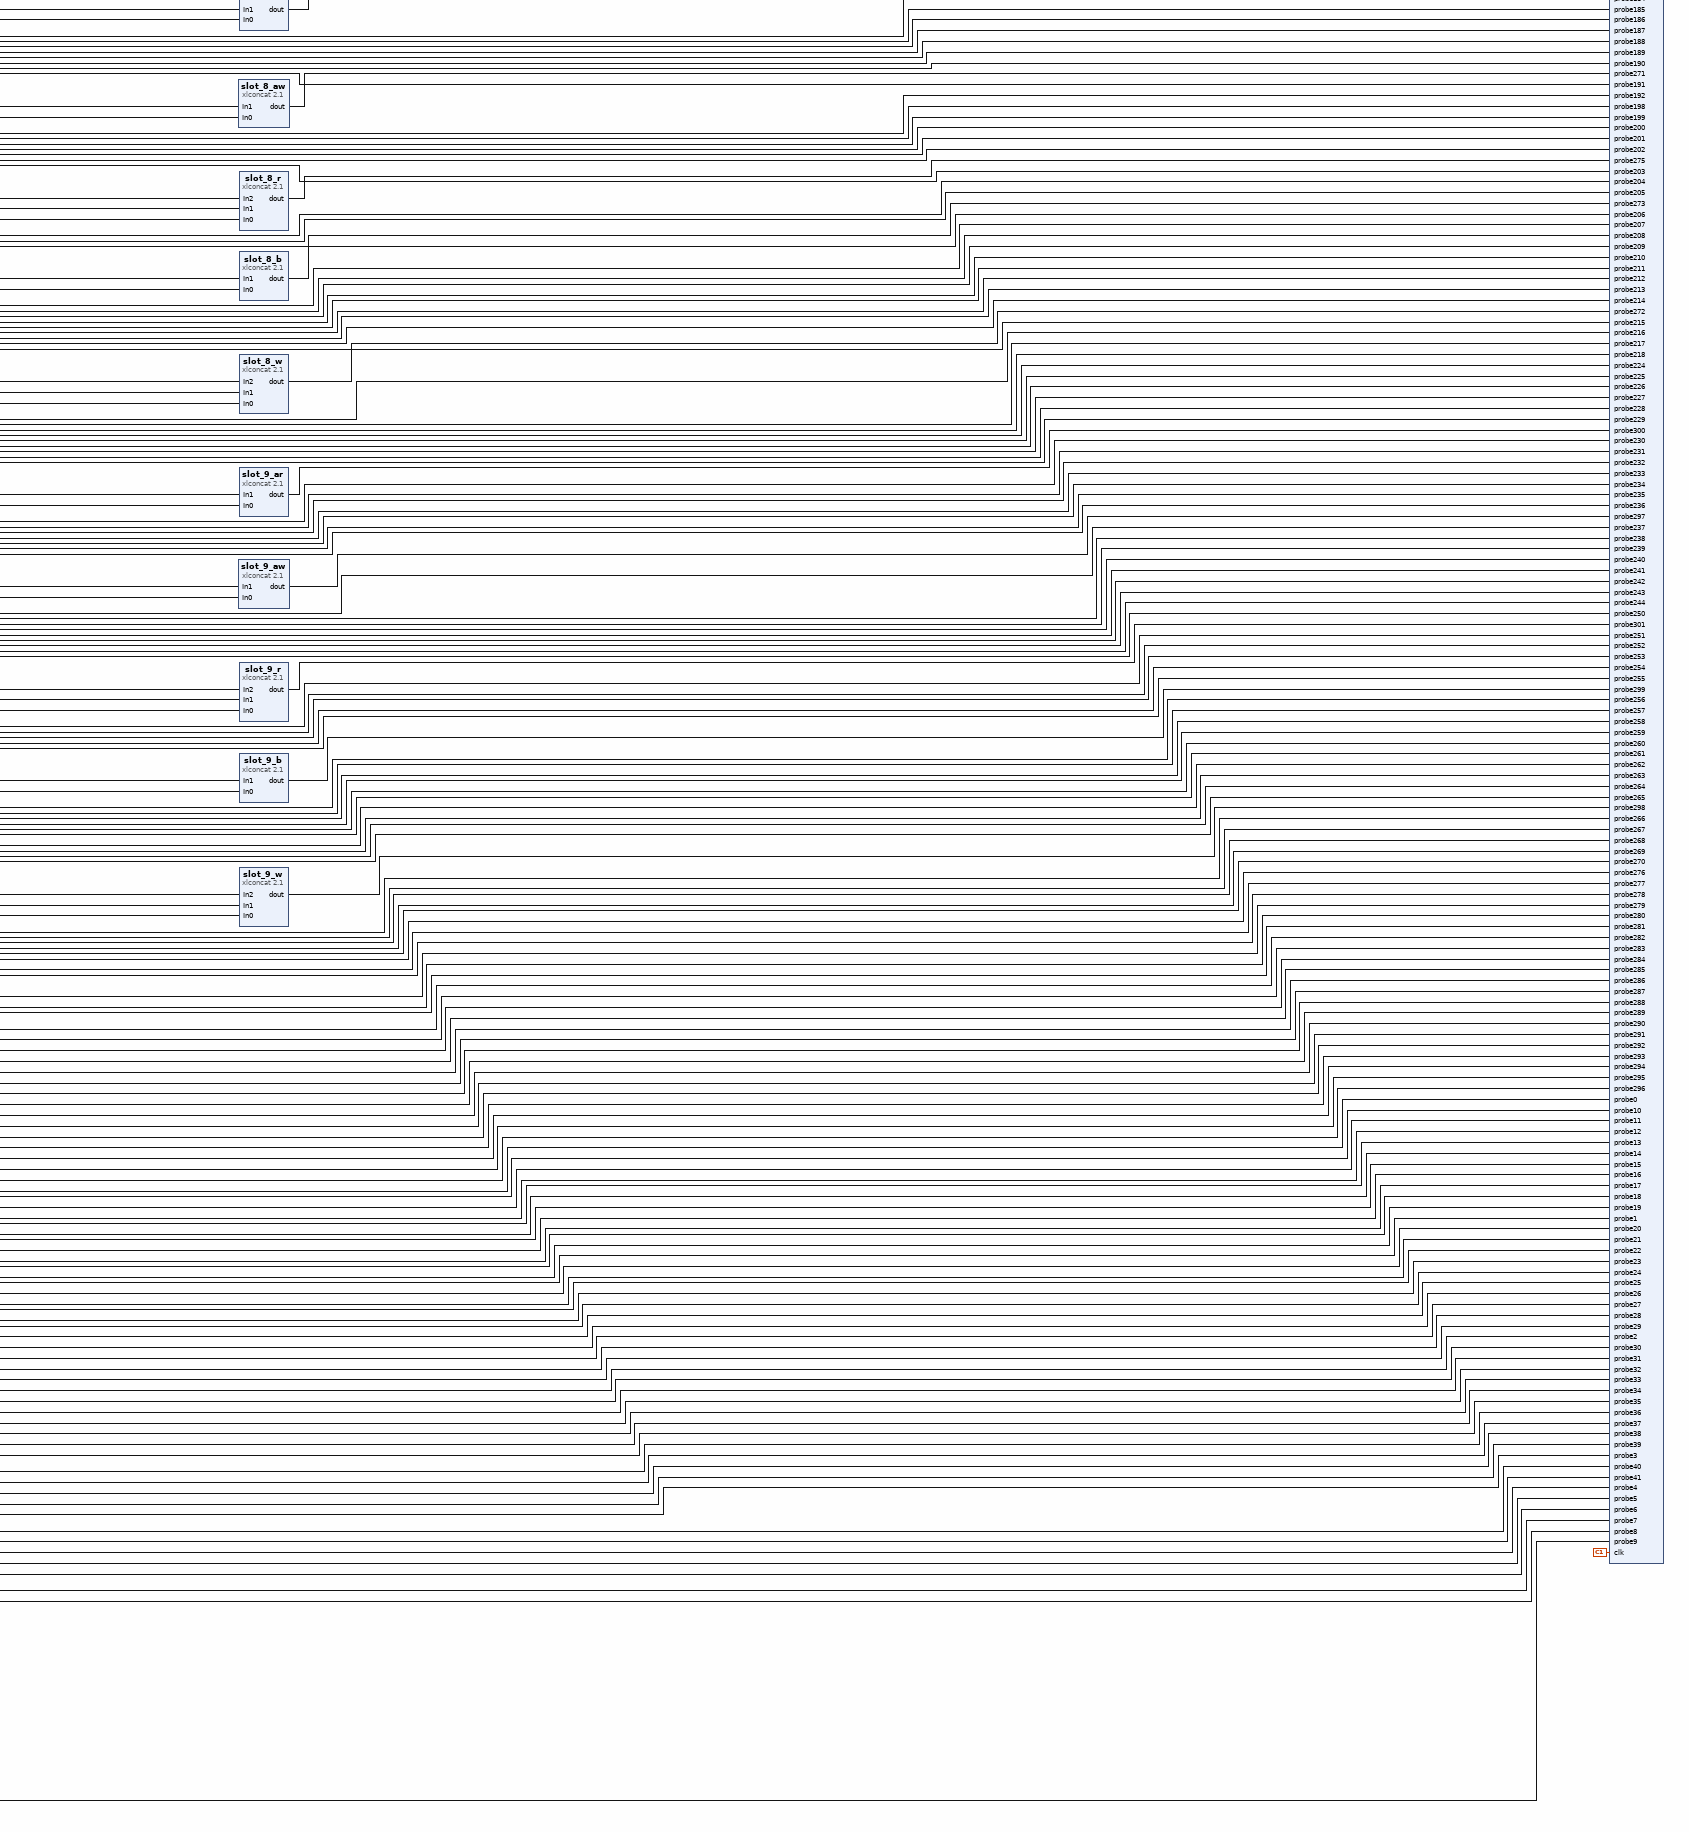
[diagram p9: block diagram of the top level, lower right part]
# Vivado block design bd_f60c, xc7z020clg400-1, Vivado 2022.2
create_bd_design bd_f60c

create_bd_intf_port -mode Monitor -vlnv xilinx.com:interface:aximm_rtl:1.0 SLOT_0_AXI
create_bd_intf_port -mode Monitor -vlnv xilinx.com:interface:aximm_rtl:1.0 SLOT_1_AXI
create_bd_intf_port -mode Monitor -vlnv xilinx.com:interface:aximm_rtl:1.0 SLOT_2_AXI
create_bd_intf_port -mode Monitor -vlnv xilinx.com:interface:aximm_rtl:1.0 SLOT_3_AXI
create_bd_intf_port -mode Monitor -vlnv xilinx.com:interface:aximm_rtl:1.0 SLOT_4_AXI
create_bd_intf_port -mode Monitor -vlnv xilinx.com:interface:aximm_rtl:1.0 SLOT_5_AXI
create_bd_intf_port -mode Monitor -vlnv xilinx.com:interface:aximm_rtl:1.0 SLOT_6_AXI
create_bd_intf_port -mode Monitor -vlnv xilinx.com:interface:aximm_rtl:1.0 SLOT_7_AXI
create_bd_intf_port -mode Monitor -vlnv xilinx.com:interface:aximm_rtl:1.0 SLOT_8_AXI
create_bd_intf_port -mode Monitor -vlnv xilinx.com:interface:aximm_rtl:1.0 SLOT_9_AXI
create_bd_intf_port -mode Monitor -vlnv xilinx.com:interface:aximm_rtl:1.0 SLOT_10_AXI
create_bd_intf_port -mode Monitor -vlnv xilinx.com:interface:aximm_rtl:1.0 SLOT_11_AXI
create_bd_port -dir I -type clk clk
set_property -dict [list \
  CONFIG.ASSOCIATED_BUSIF SLOT_0_AXI:SLOT_10_AXI:SLOT_11_AXI:SLOT_1_AXI:SLOT_2_AXI:SLOT_3_AXI:SLOT_4_AXI:SLOT_5_AXI:SLOT_6_AXI:SLOT_7_AXI:SLOT_8_AXI:SLOT_9_AXI \
  CONFIG.ASSOCIATED_RESET resetn \
] [get_bd_ports clk]
create_bd_port -dir I -from 0 -to 0 probe0
create_bd_port -dir I -from 0 -to 0 probe1
create_bd_port -dir I -from 0 -to 0 probe2
create_bd_port -dir I -from 0 -to 0 probe3
create_bd_port -dir I -from 0 -to 0 probe4
create_bd_port -dir I -from 0 -to 0 probe5
create_bd_port -dir I -from 33 -to 0 probe6
create_bd_port -dir I -from 0 -to 0 probe7
create_bd_port -dir I -from 0 -to 0 probe8
create_bd_port -dir I -from 33 -to 0 probe9
create_bd_port -dir I -from 0 -to 0 probe10
create_bd_port -dir I -from 0 -to 0 probe11
create_bd_port -dir I -from 33 -to 0 probe12
create_bd_port -dir I -from 0 -to 0 probe13
create_bd_port -dir I -from 0 -to 0 probe14
create_bd_port -dir I -from 0 -to 0 probe15
create_bd_port -dir I -from 33 -to 0 probe16
create_bd_port -dir I -from 0 -to 0 probe17
create_bd_port -dir I -from 0 -to 0 probe18
create_bd_port -dir I -from 33 -to 0 probe19
create_bd_port -dir I -from 0 -to 0 probe20
create_bd_port -dir I -from 33 -to 0 probe21
create_bd_port -dir I -from 0 -to 0 probe22
create_bd_port -dir I -from 0 -to 0 probe23
create_bd_port -dir I -from 33 -to 0 probe24
create_bd_port -dir I -from 0 -to 0 probe25
create_bd_port -dir I -from 0 -to 0 probe26
create_bd_port -dir I -from 33 -to 0 probe27
create_bd_port -dir I -from 0 -to 0 probe28
create_bd_port -dir I -from 0 -to 0 probe29
create_bd_port -dir I -from 33 -to 0 probe30
create_bd_port -dir I -from 0 -to 0 probe31
create_bd_port -dir I -from 0 -to 0 probe32
create_bd_port -dir I -from 33 -to 0 probe33
create_bd_port -dir I -from 0 -to 0 probe34
create_bd_port -dir I -from 0 -to 0 probe35
create_bd_port -dir I -from 33 -to 0 probe36
create_bd_port -dir I -from 0 -to 0 probe37
create_bd_port -dir I -from 0 -to 0 probe38
create_bd_port -dir I -from 0 -to 0 probe39
create_bd_port -dir I -from 0 -to 0 probe40
create_bd_port -dir I -from 0 -to 0 probe41
create_bd_port -dir I -type rst resetn

create_bd_cell -type ip -vlnv xilinx.com:ip:ila:6.2 ila_lib
set_property -dict [list \
  CONFIG.ALL_PROBE_SAME_MU TRUE \
  CONFIG.ALL_PROBE_SAME_MU_CNT 1 \
  CONFIG.C_ADV_TRIGGER FALSE \
  CONFIG.C_DATA_DEPTH 1024 \
  CONFIG.C_EN_STRG_QUAL 0 \
  CONFIG.C_EN_TIME_TAG 0 \
  CONFIG.C_ILA_CLK_FREQ 250833333 \
  CONFIG.C_INPUT_PIPE_STAGES 0 \
  CONFIG.C_MONITOR_TYPE Native \
  CONFIG.C_NUM_OF_PROBES 355 \
  CONFIG.C_PROBE0_MU_CNT 1 \
  CONFIG.C_PROBE0_TYPE 0 \
  CONFIG.C_PROBE0_WIDTH 1 \
  CONFIG.C_PROBE100_TYPE 0 \
  CONFIG.C_PROBE100_WIDTH 3 \
  CONFIG.C_PROBE101_TYPE 0 \
  CONFIG.C_PROBE101_WIDTH 2 \
  CONFIG.C_PROBE102_TYPE 0 \
  CONFIG.C_PROBE102_WIDTH 32 \
  CONFIG.C_PROBE103_TYPE 0 \
  CONFIG.C_PROBE103_WIDTH 2 \
  CONFIG.C_PROBE104_TYPE 0 \
  CONFIG.C_PROBE104_WIDTH 4 \
  CONFIG.C_PROBE105_TYPE 0 \
  CONFIG.C_PROBE105_WIDTH 8 \
  CONFIG.C_PROBE106_TYPE 0 \
  CONFIG.C_PROBE106_WIDTH 3 \
  CONFIG.C_PROBE107_TYPE 0 \
  CONFIG.C_PROBE107_WIDTH 3 \
  CONFIG.C_PROBE108_TYPE 0 \
  CONFIG.C_PROBE108_WIDTH 2 \
  CONFIG.C_PROBE109_TYPE 0 \
  CONFIG.C_PROBE109_WIDTH 2 \
  CONFIG.C_PROBE10_MU_CNT 1 \
  CONFIG.C_PROBE10_TYPE 0 \
  CONFIG.C_PROBE10_WIDTH 1 \
  CONFIG.C_PROBE110_TYPE 0 \
  CONFIG.C_PROBE110_WIDTH 2 \
  CONFIG.C_PROBE111_TYPE 0 \
  CONFIG.C_PROBE111_WIDTH 32 \
  CONFIG.C_PROBE112_TYPE 0 \
  CONFIG.C_PROBE112_WIDTH 2 \
  CONFIG.C_PROBE113_TYPE 0 \
  CONFIG.C_PROBE113_WIDTH 32 \
  CONFIG.C_PROBE114_TYPE 0 \
  CONFIG.C_PROBE114_WIDTH 4 \
  CONFIG.C_PROBE115_TYPE 0 \
  CONFIG.C_PROBE115_WIDTH 2 \
  CONFIG.C_PROBE116_TYPE 0 \
  CONFIG.C_PROBE116_WIDTH 3 \
  CONFIG.C_PROBE117_TYPE 0 \
  CONFIG.C_PROBE117_WIDTH 2 \
  CONFIG.C_PROBE118_TYPE 0 \
  CONFIG.C_PROBE118_WIDTH 2 \
  CONFIG.C_PROBE119_TYPE 0 \
  CONFIG.C_PROBE119_WIDTH 3 \
  CONFIG.C_PROBE11_MU_CNT 1 \
  CONFIG.C_PROBE11_TYPE 0 \
  CONFIG.C_PROBE11_WIDTH 1 \
  CONFIG.C_PROBE120_TYPE 0 \
  CONFIG.C_PROBE120_WIDTH 2 \
  CONFIG.C_PROBE121_TYPE 0 \
  CONFIG.C_PROBE121_WIDTH 32 \
  CONFIG.C_PROBE122_TYPE 0 \
  CONFIG.C_PROBE122_WIDTH 2 \
  CONFIG.C_PROBE123_TYPE 0 \
  CONFIG.C_PROBE123_WIDTH 4 \
  CONFIG.C_PROBE124_TYPE 0 \
  CONFIG.C_PROBE124_WIDTH 8 \
  CONFIG.C_PROBE125_TYPE 0 \
  CONFIG.C_PROBE125_WIDTH 3 \
  CONFIG.C_PROBE126_TYPE 0 \
  CONFIG.C_PROBE126_WIDTH 3 \
  CONFIG.C_PROBE127_TYPE 0 \
  CONFIG.C_PROBE127_WIDTH 2 \
  CONFIG.C_PROBE128_TYPE 0 \
  CONFIG.C_PROBE128_WIDTH 32 \
  CONFIG.C_PROBE129_TYPE 0 \
  CONFIG.C_PROBE129_WIDTH 2 \
  CONFIG.C_PROBE12_MU_CNT 1 \
  CONFIG.C_PROBE12_TYPE 0 \
  CONFIG.C_PROBE12_WIDTH 1 \
  CONFIG.C_PROBE130_TYPE 0 \
  CONFIG.C_PROBE130_WIDTH 4 \
  CONFIG.C_PROBE131_TYPE 0 \
  CONFIG.C_PROBE131_WIDTH 8 \
  CONFIG.C_PROBE132_TYPE 0 \
  CONFIG.C_PROBE132_WIDTH 3 \
  CONFIG.C_PROBE133_TYPE 0 \
  CONFIG.C_PROBE133_WIDTH 3 \
  CONFIG.C_PROBE134_TYPE 0 \
  CONFIG.C_PROBE134_WIDTH 2 \
  CONFIG.C_PROBE135_TYPE 0 \
  CONFIG.C_PROBE135_WIDTH 2 \
  CONFIG.C_PROBE136_TYPE 0 \
  CONFIG.C_PROBE136_WIDTH 2 \
  CONFIG.C_PROBE137_TYPE 0 \
  CONFIG.C_PROBE137_WIDTH 32 \
  CONFIG.C_PROBE138_TYPE 0 \
  CONFIG.C_PROBE138_WIDTH 2 \
  CONFIG.C_PROBE139_TYPE 0 \
  CONFIG.C_PROBE139_WIDTH 32 \
  CONFIG.C_PROBE13_MU_CNT 1 \
  CONFIG.C_PROBE13_TYPE 0 \
  CONFIG.C_PROBE13_WIDTH 1 \
  CONFIG.C_PROBE140_TYPE 0 \
  CONFIG.C_PROBE140_WIDTH 4 \
  CONFIG.C_PROBE141_TYPE 0 \
  CONFIG.C_PROBE141_WIDTH 2 \
  CONFIG.C_PROBE142_TYPE 0 \
  CONFIG.C_PROBE142_WIDTH 3 \
  CONFIG.C_PROBE143_TYPE 0 \
  CONFIG.C_PROBE143_WIDTH 2 \
  CONFIG.C_PROBE144_TYPE 0 \
  CONFIG.C_PROBE144_WIDTH 2 \
  CONFIG.C_PROBE145_TYPE 0 \
  CONFIG.C_PROBE145_WIDTH 3 \
  CONFIG.C_PROBE146_TYPE 0 \
  CONFIG.C_PROBE146_WIDTH 2 \
  CONFIG.C_PROBE147_TYPE 0 \
  CONFIG.C_PROBE147_WIDTH 32 \
  CONFIG.C_PROBE148_TYPE 0 \
  CONFIG.C_PROBE148_WIDTH 2 \
  CONFIG.C_PROBE149_TYPE 0 \
  CONFIG.C_PROBE149_WIDTH 4 \
  CONFIG.C_PROBE14_MU_CNT 1 \
  CONFIG.C_PROBE14_TYPE 0 \
  CONFIG.C_PROBE14_WIDTH 1 \
  CONFIG.C_PROBE150_TYPE 0 \
  CONFIG.C_PROBE150_WIDTH 8 \
  CONFIG.C_PROBE151_TYPE 0 \
  CONFIG.C_PROBE151_WIDTH 3 \
  CONFIG.C_PROBE152_TYPE 0 \
  CONFIG.C_PROBE152_WIDTH 3 \
  CONFIG.C_PROBE153_TYPE 0 \
  CONFIG.C_PROBE153_WIDTH 2 \
  CONFIG.C_PROBE154_TYPE 0 \
  CONFIG.C_PROBE154_WIDTH 32 \
  CONFIG.C_PROBE155_TYPE 0 \
  CONFIG.C_PROBE155_WIDTH 2 \
  CONFIG.C_PROBE156_TYPE 0 \
  CONFIG.C_PROBE156_WIDTH 4 \
  CONFIG.C_PROBE157_TYPE 0 \
  CONFIG.C_PROBE157_WIDTH 8 \
  CONFIG.C_PROBE158_TYPE 0 \
  CONFIG.C_PROBE158_WIDTH 3 \
  CONFIG.C_PROBE159_TYPE 0 \
  CONFIG.C_PROBE159_WIDTH 3 \
  CONFIG.C_PROBE15_MU_CNT 1 \
  CONFIG.C_PROBE15_TYPE 0 \
  CONFIG.C_PROBE15_WIDTH 1 \
  CONFIG.C_PROBE160_TYPE 0 \
  CONFIG.C_PROBE160_WIDTH 2 \
  CONFIG.C_PROBE161_TYPE 0 \
  CONFIG.C_PROBE161_WIDTH 2 \
  CONFIG.C_PROBE162_TYPE 0 \
  CONFIG.C_PROBE162_WIDTH 2 \
  CONFIG.C_PROBE163_TYPE 0 \
  CONFIG.C_PROBE163_WIDTH 32 \
  CONFIG.C_PROBE164_TYPE 0 \
  CONFIG.C_PROBE164_WIDTH 2 \
  CONFIG.C_PROBE165_TYPE 0 \
  CONFIG.C_PROBE165_WIDTH 32 \
  CONFIG.C_PROBE166_TYPE 0 \
  CONFIG.C_PROBE166_WIDTH 4 \
  CONFIG.C_PROBE167_TYPE 0 \
  CONFIG.C_PROBE167_WIDTH 2 \
  CONFIG.C_PROBE168_TYPE 0 \
  CONFIG.C_PROBE168_WIDTH 3 \
  CONFIG.C_PROBE169_TYPE 0 \
  CONFIG.C_PROBE169_WIDTH 2 \
  CONFIG.C_PROBE16_MU_CNT 1 \
  CONFIG.C_PROBE16_TYPE 0 \
  CONFIG.C_PROBE16_WIDTH 1 \
  CONFIG.C_PROBE170_TYPE 0 \
  CONFIG.C_PROBE170_WIDTH 2 \
  CONFIG.C_PROBE171_TYPE 0 \
  CONFIG.C_PROBE171_WIDTH 3 \
  CONFIG.C_PROBE172_TYPE 0 \
  CONFIG.C_PROBE172_WIDTH 2 \
  CONFIG.C_PROBE173_TYPE 0 \
  CONFIG.C_PROBE173_WIDTH 32 \
  CONFIG.C_PROBE174_TYPE 0 \
  CONFIG.C_PROBE174_WIDTH 2 \
  CONFIG.C_PROBE175_TYPE 0 \
  CONFIG.C_PROBE175_WIDTH 4 \
  CONFIG.C_PROBE176_TYPE 0 \
  CONFIG.C_PROBE176_WIDTH 8 \
  CONFIG.C_PROBE177_TYPE 0 \
  CONFIG.C_PROBE177_WIDTH 3 \
  CONFIG.C_PROBE178_TYPE 0 \
  CONFIG.C_PROBE178_WIDTH 3 \
  CONFIG.C_PROBE179_TYPE 0 \
  CONFIG.C_PROBE179_WIDTH 2 \
  CONFIG.C_PROBE17_MU_CNT 1 \
  CONFIG.C_PROBE17_TYPE 0 \
  CONFIG.C_PROBE17_WIDTH 1 \
  CONFIG.C_PROBE180_TYPE 0 \
  CONFIG.C_PROBE180_WIDTH 32 \
  CONFIG.C_PROBE181_TYPE 0 \
  CONFIG.C_PROBE181_WIDTH 2 \
  CONFIG.C_PROBE182_TYPE 0 \
  CONFIG.C_PROBE182_WIDTH 4 \
  CONFIG.C_PROBE183_TYPE 0 \
  CONFIG.C_PROBE183_WIDTH 8 \
  CONFIG.C_PROBE184_TYPE 0 \
  CONFIG.C_PROBE184_WIDTH 3 \
  CONFIG.C_PROBE185_TYPE 0 \
  CONFIG.C_PROBE185_WIDTH 3 \
  CONFIG.C_PROBE186_TYPE 0 \
  CONFIG.C_PROBE186_WIDTH 2 \
  CONFIG.C_PROBE187_TYPE 0 \
  CONFIG.C_PROBE187_WIDTH 2 \
  CONFIG.C_PROBE188_TYPE 0 \
  CONFIG.C_PROBE188_WIDTH 2 \
  CONFIG.C_PROBE189_TYPE 0 \
  CONFIG.C_PROBE189_WIDTH 32 \
  CONFIG.C_PROBE18_MU_CNT 1 \
  CONFIG.C_PROBE18_TYPE 0 \
  CONFIG.C_PROBE18_WIDTH 1 \
  CONFIG.C_PROBE190_TYPE 0 \
  CONFIG.C_PROBE190_WIDTH 2 \
  CONFIG.C_PROBE191_TYPE 0 \
  CONFIG.C_PROBE191_WIDTH 32 \
  CONFIG.C_PROBE192_TYPE 0 \
  CONFIG.C_PROBE192_WIDTH 4 \
  CONFIG.C_PROBE193_TYPE 0 \
  CONFIG.C_PROBE193_WIDTH 2 \
  CONFIG.C_PROBE194_TYPE 0 \
  CONFIG.C_PROBE194_WIDTH 3 \
  CONFIG.C_PROBE195_TYPE 0 \
  CONFIG.C_PROBE195_WIDTH 2 \
  CONFIG.C_PROBE196_TYPE 0 \
  CONFIG.C_PROBE196_WIDTH 2 \
  CONFIG.C_PROBE197_TYPE 0 \
  CONFIG.C_PROBE197_WIDTH 3 \
  CONFIG.C_PROBE198_TYPE 0 \
  CONFIG.C_PROBE198_WIDTH 2 \
  CONFIG.C_PROBE199_TYPE 0 \
  CONFIG.C_PROBE199_WIDTH 32 \
  CONFIG.C_PROBE19_MU_CNT 1 \
  CONFIG.C_PROBE19_TYPE 0 \
  CONFIG.C_PROBE19_WIDTH 1 \
  CONFIG.C_PROBE1_MU_CNT 1 \
  CONFIG.C_PROBE1_TYPE 0 \
  CONFIG.C_PROBE1_WIDTH 1 \
  CONFIG.C_PROBE200_TYPE 0 \
  CONFIG.C_PROBE200_WIDTH 2 \
  CONFIG.C_PROBE201_TYPE 0 \
  CONFIG.C_PROBE201_WIDTH 4 \
  CONFIG.C_PROBE202_TYPE 0 \
  CONFIG.C_PROBE202_WIDTH 4 \
  CONFIG.C_PROBE203_TYPE 0 \
  CONFIG.C_PROBE203_WIDTH 3 \
  CONFIG.C_PROBE204_TYPE 0 \
  CONFIG.C_PROBE204_WIDTH 3 \
  CONFIG.C_PROBE205_TYPE 0 \
  CONFIG.C_PROBE205_WIDTH 2 \
  CONFIG.C_PROBE206_TYPE 0 \
  CONFIG.C_PROBE206_WIDTH 32 \
  CONFIG.C_PROBE207_TYPE 0 \
  CONFIG.C_PROBE207_WIDTH 2 \
  CONFIG.C_PROBE208_TYPE 0 \
  CONFIG.C_PROBE208_WIDTH 4 \
  CONFIG.C_PROBE209_TYPE 0 \
  CONFIG.C_PROBE209_WIDTH 4 \
  CONFIG.C_PROBE20_MU_CNT 1 \
  CONFIG.C_PROBE20_TYPE 0 \
  CONFIG.C_PROBE20_WIDTH 1 \
  CONFIG.C_PROBE210_TYPE 0 \
  CONFIG.C_PROBE210_WIDTH 3 \
  CONFIG.C_PROBE211_TYPE 0 \
  CONFIG.C_PROBE211_WIDTH 3 \
  CONFIG.C_PROBE212_TYPE 0 \
  CONFIG.C_PROBE212_WIDTH 2 \
  CONFIG.C_PROBE213_TYPE 0 \
  CONFIG.C_PROBE213_WIDTH 2 \
  CONFIG.C_PROBE214_TYPE 0 \
  CONFIG.C_PROBE214_WIDTH 2 \
  CONFIG.C_PROBE215_TYPE 0 \
  CONFIG.C_PROBE215_WIDTH 32 \
  CONFIG.C_PROBE216_TYPE 0 \
  CONFIG.C_PROBE216_WIDTH 2 \
  CONFIG.C_PROBE217_TYPE 0 \
  CONFIG.C_PROBE217_WIDTH 32 \
  CONFIG.C_PROBE218_TYPE 0 \
  CONFIG.C_PROBE218_WIDTH 4 \
  CONFIG.C_PROBE219_TYPE 0 \
  CONFIG.C_PROBE219_WIDTH 2 \
  CONFIG.C_PROBE21_MU_CNT 1 \
  CONFIG.C_PROBE21_TYPE 0 \
  CONFIG.C_PROBE21_WIDTH 1 \
  CONFIG.C_PROBE220_TYPE 0 \
  CONFIG.C_PROBE220_WIDTH 3 \
  CONFIG.C_PROBE221_TYPE 0 \
  CONFIG.C_PROBE221_WIDTH 2 \
  CONFIG.C_PROBE222_TYPE 0 \
  CONFIG.C_PROBE222_WIDTH 2 \
  CONFIG.C_PROBE223_TYPE 0 \
  CONFIG.C_PROBE223_WIDTH 3 \
  CONFIG.C_PROBE224_TYPE 0 \
  CONFIG.C_PROBE224_WIDTH 2 \
  CONFIG.C_PROBE225_TYPE 0 \
  CONFIG.C_PROBE225_WIDTH 32 \
  CONFIG.C_PROBE226_TYPE 0 \
  CONFIG.C_PROBE226_WIDTH 2 \
  CONFIG.C_PROBE227_TYPE 0 \
  CONFIG.C_PROBE227_WIDTH 4 \
  CONFIG.C_PROBE228_TYPE 0 \
  CONFIG.C_PROBE228_WIDTH 4 \
  CONFIG.C_PROBE229_TYPE 0 \
  CONFIG.C_PROBE229_WIDTH 3 \
  CONFIG.C_PROBE22_MU_CNT 1 \
  CONFIG.C_PROBE22_TYPE 0 \
  CONFIG.C_PROBE22_WIDTH 1 \
  CONFIG.C_PROBE230_TYPE 0 \
  CONFIG.C_PROBE230_WIDTH 3 \
  CONFIG.C_PROBE231_TYPE 0 \
  CONFIG.C_PROBE231_WIDTH 2 \
  CONFIG.C_PROBE232_TYPE 0 \
  CONFIG.C_PROBE232_WIDTH 32 \
  CONFIG.C_PROBE233_TYPE 0 \
  CONFIG.C_PROBE233_WIDTH 2 \
  CONFIG.C_PROBE234_TYPE 0 \
  CONFIG.C_PROBE234_WIDTH 4 \
  CONFIG.C_PROBE235_TYPE 0 \
  CONFIG.C_PROBE235_WIDTH 4 \
  CONFIG.C_PROBE236_TYPE 0 \
  CONFIG.C_PROBE236_WIDTH 3 \
  CONFIG.C_PROBE237_TYPE 0 \
  CONFIG.C_PROBE237_WIDTH 3 \
  CONFIG.C_PROBE238_TYPE 0 \
  CONFIG.C_PROBE238_WIDTH 2 \
  CONFIG.C_PROBE239_TYPE 0 \
  CONFIG.C_PROBE239_WIDTH 2 \
  CONFIG.C_PROBE23_MU_CNT 1 \
  CONFIG.C_PROBE23_TYPE 0 \
  CONFIG.C_PROBE23_WIDTH 1 \
  CONFIG.C_PROBE240_TYPE 0 \
  CONFIG.C_PROBE240_WIDTH 2 \
  CONFIG.C_PROBE241_TYPE 0 \
  CONFIG.C_PROBE241_WIDTH 32 \
  CONFIG.C_PROBE242_TYPE 0 \
  CONFIG.C_PROBE242_WIDTH 2 \
  CONFIG.C_PROBE243_TYPE 0 \
  CONFIG.C_PROBE243_WIDTH 32 \
  CONFIG.C_PROBE244_TYPE 0 \
  CONFIG.C_PROBE244_WIDTH 4 \
  CONFIG.C_PROBE245_TYPE 0 \
  CONFIG.C_PROBE245_WIDTH 2 \
  CONFIG.C_PROBE246_TYPE 0 \
  CONFIG.C_PROBE246_WIDTH 3 \
  CONFIG.C_PROBE247_TYPE 0 \
  CONFIG.C_PROBE247_WIDTH 2 \
  CONFIG.C_PROBE248_TYPE 0 \
  CONFIG.C_PROBE248_WIDTH 2 \
  CONFIG.C_PROBE249_TYPE 0 \
  CONFIG.C_PROBE249_WIDTH 3 \
  CONFIG.C_PROBE24_MU_CNT 1 \
  CONFIG.C_PROBE24_TYPE 0 \
  CONFIG.C_PROBE24_WIDTH 1 \
  CONFIG.C_PROBE250_TYPE 0 \
  CONFIG.C_PROBE250_WIDTH 2 \
  CONFIG.C_PROBE251_TYPE 0 \
  CONFIG.C_PROBE251_WIDTH 32 \
  CONFIG.C_PROBE252_TYPE 0 \
  CONFIG.C_PROBE252_WIDTH 2 \
  CONFIG.C_PROBE253_TYPE 0 \
  CONFIG.C_PROBE253_WIDTH 4 \
  CONFIG.C_PROBE254_TYPE 0 \
  CONFIG.C_PROBE254_WIDTH 4 \
  CONFIG.C_PROBE255_TYPE 0 \
  CONFIG.C_PROBE255_WIDTH 3 \
  CONFIG.C_PROBE256_TYPE 0 \
  CONFIG.C_PROBE256_WIDTH 3 \
  CONFIG.C_PROBE257_TYPE 0 \
  CONFIG.C_PROBE257_WIDTH 2 \
  CONFIG.C_PROBE258_TYPE 0 \
  CONFIG.C_PROBE258_WIDTH 32 \
  CONFIG.C_PROBE259_TYPE 0 \
  CONFIG.C_PROBE259_WIDTH 2 \
  CONFIG.C_PROBE25_MU_CNT 1 \
  CONFIG.C_PROBE25_TYPE 0 \
  CONFIG.C_PROBE25_WIDTH 1 \
  CONFIG.C_PROBE260_TYPE 0 \
  CONFIG.C_PROBE260_WIDTH 4 \
  CONFIG.C_PROBE261_TYPE 0 \
  CONFIG.C_PROBE261_WIDTH 4 \
  CONFIG.C_PROBE262_TYPE 0 \
  CONFIG.C_PROBE262_WIDTH 3 \
  CONFIG.C_PROBE263_TYPE 0 \
  CONFIG.C_PROBE263_WIDTH 3 \
  CONFIG.C_PROBE264_TYPE 0 \
  CONFIG.C_PROBE264_WIDTH 2 \
  CONFIG.C_PROBE265_TYPE 0 \
  CONFIG.C_PROBE265_WIDTH 2 \
  CONFIG.C_PROBE266_TYPE 0 \
  CONFIG.C_PROBE266_WIDTH 2 \
  CONFIG.C_PROBE267_TYPE 0 \
  CONFIG.C_PROBE267_WIDTH 32 \
  CONFIG.C_PROBE268_TYPE 0 \
  CONFIG.C_PROBE268_WIDTH 2 \
  CONFIG.C_PROBE269_TYPE 0 \
  CONFIG.C_PROBE269_WIDTH 32 \
  CONFIG.C_PROBE26_MU_CNT 1 \
  CONFIG.C_PROBE26_TYPE 0 \
  CONFIG.C_PROBE26_WIDTH 1 \
  CONFIG.C_PROBE270_TYPE 0 \
  CONFIG.C_PROBE270_WIDTH 4 \
  CONFIG.C_PROBE271_TYPE 0 \
  CONFIG.C_PROBE271_WIDTH 2 \
  CONFIG.C_PROBE272_TYPE 0 \
  CONFIG.C_PROBE272_WIDTH 3 \
  CONFIG.C_PROBE273_TYPE 0 \
  CONFIG.C_PROBE273_WIDTH 2 \
  CONFIG.C_PROBE274_TYPE 0 \
  CONFIG.C_PROBE274_WIDTH 2 \
  CONFIG.C_PROBE275_TYPE 0 \
  CONFIG.C_PROBE275_WIDTH 3 \
  CONFIG.C_PROBE276_TYPE 0 \
  CONFIG.C_PROBE276_WIDTH 2 \
  CONFIG.C_PROBE277_TYPE 0 \
  CONFIG.C_PROBE277_WIDTH 32 \
  CONFIG.C_PROBE278_TYPE 0 \
  CONFIG.C_PROBE278_WIDTH 2 \
  CONFIG.C_PROBE279_TYPE 0 \
  CONFIG.C_PROBE279_WIDTH 4 \
  CONFIG.C_PROBE27_MU_CNT 1 \
  CONFIG.C_PROBE27_TYPE 0 \
  CONFIG.C_PROBE27_WIDTH 1 \
  CONFIG.C_PROBE280_TYPE 0 \
  CONFIG.C_PROBE280_WIDTH 4 \
  CONFIG.C_PROBE281_TYPE 0 \
  CONFIG.C_PROBE281_WIDTH 3 \
  CONFIG.C_PROBE282_TYPE 0 \
  CONFIG.C_PROBE282_WIDTH 3 \
  CONFIG.C_PROBE283_TYPE 0 \
  CONFIG.C_PROBE283_WIDTH 2 \
  CONFIG.C_PROBE284_TYPE 0 \
  CONFIG.C_PROBE284_WIDTH 32 \
  CONFIG.C_PROBE285_TYPE 0 \
  CONFIG.C_PROBE285_WIDTH 2 \
  CONFIG.C_PROBE286_TYPE 0 \
  CONFIG.C_PROBE286_WIDTH 4 \
  CONFIG.C_PROBE287_TYPE 0 \
  CONFIG.C_PROBE287_WIDTH 4 \
  CONFIG.C_PROBE288_TYPE 0 \
  CONFIG.C_PROBE288_WIDTH 3 \
  CONFIG.C_PROBE289_TYPE 0 \
  CONFIG.C_PROBE289_WIDTH 3 \
  CONFIG.C_PROBE28_MU_CNT 1 \
  CONFIG.C_PROBE28_TYPE 0 \
  CONFIG.C_PROBE28_WIDTH 1 \
  CONFIG.C_PROBE290_TYPE 0 \
  CONFIG.C_PROBE290_WIDTH 2 \
  CONFIG.C_PROBE291_TYPE 0 \
  CONFIG.C_PROBE291_WIDTH 2 \
  CONFIG.C_PROBE292_TYPE 0 \
  CONFIG.C_PROBE292_WIDTH 2 \
  CONFIG.C_PROBE293_TYPE 0 \
  CONFIG.C_PROBE293_WIDTH 32 \
  CONFIG.C_PROBE294_TYPE 0 \
  CONFIG.C_PROBE294_WIDTH 2 \
  CONFIG.C_PROBE295_TYPE 0 \
  CONFIG.C_PROBE295_WIDTH 32 \
  CONFIG.C_PROBE296_TYPE 0 \
  CONFIG.C_PROBE296_WIDTH 3 \
  CONFIG.C_PROBE297_TYPE 0 \
  CONFIG.C_PROBE297_WIDTH 2 \
  CONFIG.C_PROBE298_TYPE 0 \
  CONFIG.C_PROBE298_WIDTH 3 \
  CONFIG.C_PROBE299_TYPE 0 \
  CONFIG.C_PROBE299_WIDTH 2 \
  CONFIG.C_PROBE29_MU_CNT 1 \
  CONFIG.C_PROBE29_TYPE 0 \
  CONFIG.C_PROBE29_WIDTH 1 \
  CONFIG.C_PROBE2_MU_CNT 1 \
  CONFIG.C_PROBE2_TYPE 0 \
  CONFIG.C_PROBE2_WIDTH 1 \
  CONFIG.C_PROBE300_TYPE 0 \
  CONFIG.C_PROBE300_WIDTH 2 \
  CONFIG.C_PROBE301_TYPE 0 \
  CONFIG.C_PROBE301_WIDTH 3 \
  CONFIG.C_PROBE302_TYPE 0 \
  CONFIG.C_PROBE302_WIDTH 2 \
  CONFIG.C_PROBE303_TYPE 0 \
  CONFIG.C_PROBE303_WIDTH 32 \
  CONFIG.C_PROBE304_TYPE 0 \
  CONFIG.C_PROBE304_WIDTH 2 \
  CONFIG.C_PROBE305_TYPE 0 \
  CONFIG.C_PROBE305_WIDTH 4 \
  CONFIG.C_PROBE306_TYPE 0 \
  CONFIG.C_PROBE306_WIDTH 4 \
  CONFIG.C_PROBE307_TYPE 0 \
  CONFIG.C_PROBE307_WIDTH 3 \
  CONFIG.C_PROBE308_TYPE 0 \
  CONFIG.C_PROBE308_WIDTH 3 \
  CONFIG.C_PROBE309_TYPE 0 \
  CONFIG.C_PROBE309_WIDTH 2 \
  CONFIG.C_PROBE30_MU_CNT 1 \
  CONFIG.C_PROBE30_TYPE 0 \
  CONFIG.C_PROBE30_WIDTH 1 \
  CONFIG.C_PROBE310_TYPE 0 \
  CONFIG.C_PROBE310_WIDTH 32 \
  CONFIG.C_PROBE311_TYPE 0 \
  CONFIG.C_PROBE311_WIDTH 2 \
  CONFIG.C_PROBE312_TYPE 0 \
  CONFIG.C_PROBE312_WIDTH 4 \
  CONFIG.C_PROBE313_TYPE 0 \
  CONFIG.C_PROBE313_WIDTH 4 \
  CONFIG.C_PROBE314_TYPE 0 \
  CONFIG.C_PROBE314_WIDTH 3 \
  CONFIG.C_PROBE315_TYPE 0 \
  CONFIG.C_PROBE315_WIDTH 3 \
  CONFIG.C_PROBE316_TYPE 0 \
  CONFIG.C_PROBE316_WIDTH 2 \
  CONFIG.C_PROBE317_TYPE 0 \
  CONFIG.C_PROBE317_WIDTH 2 \
  CONFIG.C_PROBE318_TYPE 0 \
  CONFIG.C_PROBE318_WIDTH 2 \
  CONFIG.C_PROBE319_TYPE 0 \
  CONFIG.C_PROBE319_WIDTH 32 \
  CONFIG.C_PROBE31_MU_CNT 1 \
  CONFIG.C_PROBE31_TYPE 0 \
  CONFIG.C_PROBE31_WIDTH 1 \
  CONFIG.C_PROBE320_TYPE 0 \
  CONFIG.C_PROBE320_WIDTH 2 \
  CONFIG.C_PROBE321_TYPE 0 \
  CONFIG.C_PROBE321_WIDTH 32 \
  CONFIG.C_PROBE322_TYPE 0 \
  CONFIG.C_PROBE322_WIDTH 4 \
  CONFIG.C_PROBE323_TYPE 0 \
  CONFIG.C_PROBE323_WIDTH 2 \
  CONFIG.C_PROBE324_TYPE 0 \
  CONFIG.C_PROBE324_WIDTH 3 \
  CONFIG.C_PROBE325_TYPE 0 \
  CONFIG.C_PROBE325_WIDTH 2 \
  CONFIG.C_PROBE326_TYPE 0 \
  CONFIG.C_PROBE326_WIDTH 2 \
  CONFIG.C_PROBE327_TYPE 0 \
  CONFIG.C_PROBE327_WIDTH 3 \
  CONFIG.C_PROBE328_TYPE 0 \
  CONFIG.C_PROBE328_WIDTH 2 \
  CONFIG.C_PROBE329_TYPE 0 \
  CONFIG.C_PROBE329_WIDTH 32 \
  CONFIG.C_PROBE32_MU_CNT 1 \
  CONFIG.C_PROBE32_TYPE 0 \
  CONFIG.C_PROBE32_WIDTH 1 \
  CONFIG.C_PROBE330_TYPE 0 \
  CONFIG.C_PROBE330_WIDTH 2 \
  CONFIG.C_PROBE331_TYPE 0 \
  CONFIG.C_PROBE331_WIDTH 4 \
  CONFIG.C_PROBE332_TYPE 0 \
  CONFIG.C_PROBE332_WIDTH 4 \
  CONFIG.C_PROBE333_TYPE 0 \
  CONFIG.C_PROBE333_WIDTH 3 \
  CONFIG.C_PROBE334_TYPE 0 \
  CONFIG.C_PROBE334_WIDTH 3 \
  CONFIG.C_PROBE335_TYPE 0 \
  CONFIG.C_PROBE335_WIDTH 2 \
  CONFIG.C_PROBE336_TYPE 0 \
  CONFIG.C_PROBE336_WIDTH 32 \
  CONFIG.C_PROBE337_TYPE 0 \
  CONFIG.C_PROBE337_WIDTH 2 \
  CONFIG.C_PROBE338_TYPE 0 \
  CONFIG.C_PROBE338_WIDTH 4 \
  CONFIG.C_PROBE339_TYPE 0 \
  CONFIG.C_PROBE339_WIDTH 4 \
  CONFIG.C_PROBE33_MU_CNT 1 \
  CONFIG.C_PROBE33_TYPE 0 \
  CONFIG.C_PROBE33_WIDTH 1 \
  CONFIG.C_PROBE340_TYPE 0 \
  CONFIG.C_PROBE340_WIDTH 3 \
  CONFIG.C_PROBE341_TYPE 0 \
  CONFIG.C_PROBE341_WIDTH 3 \
  CONFIG.C_PROBE342_TYPE 0 \
  CONFIG.C_PROBE342_WIDTH 2 \
  CONFIG.C_PROBE343_TYPE 0 \
  CONFIG.C_PROBE343_WIDTH 2 \
  CONFIG.C_PROBE344_TYPE 0 \
  CONFIG.C_PROBE344_WIDTH 2 \
  CONFIG.C_PROBE345_TYPE 0 \
  CONFIG.C_PROBE345_WIDTH 32 \
  CONFIG.C_PROBE346_TYPE 0 \
  CONFIG.C_PROBE346_WIDTH 1 \
  CONFIG.C_PROBE347_TYPE 0 \
  CONFIG.C_PROBE347_WIDTH 2 \
  CONFIG.C_PROBE348_TYPE 0 \
  CONFIG.C_PROBE348_WIDTH 32 \
  CONFIG.C_PROBE349_TYPE 0 \
  CONFIG.C_PROBE349_WIDTH 4 \
  CONFIG.C_PROBE34_MU_CNT 1 \
  CONFIG.C_PROBE34_TYPE 0 \
  CONFIG.C_PROBE34_WIDTH 1 \
  CONFIG.C_PROBE350_TYPE 0 \
  CONFIG.C_PROBE350_WIDTH 2 \
  CONFIG.C_PROBE351_TYPE 0 \
  CONFIG.C_PROBE351_WIDTH 3 \
  CONFIG.C_PROBE352_TYPE 0 \
  CONFIG.C_PROBE352_WIDTH 2 \
  CONFIG.C_PROBE353_TYPE 0 \
  CONFIG.C_PROBE353_WIDTH 2 \
  CONFIG.C_PROBE354_TYPE 0 \
  CONFIG.C_PROBE354_WIDTH 3 \
  CONFIG.C_PROBE35_MU_CNT 1 \
  CONFIG.C_PROBE35_TYPE 0 \
  CONFIG.C_PROBE35_WIDTH 1 \
  CONFIG.C_PROBE36_MU_CNT 1 \
  CONFIG.C_PROBE36_TYPE 0 \
  CONFIG.C_PROBE36_WIDTH 1 \
  CONFIG.C_PROBE37_MU_CNT 1 \
  CONFIG.C_PROBE37_TYPE 0 \
  CONFIG.C_PROBE37_WIDTH 1 \
  CONFIG.C_PROBE38_MU_CNT 1 \
  CONFIG.C_PROBE38_TYPE 0 \
  CONFIG.C_PROBE38_WIDTH 1 \
  CONFIG.C_PROBE39_MU_CNT 1 \
  CONFIG.C_PROBE39_TYPE 0 \
  CONFIG.C_PROBE39_WIDTH 1 \
  CONFIG.C_PROBE3_MU_CNT 1 \
  CONFIG.C_PROBE3_TYPE 0 \
  CONFIG.C_PROBE3_WIDTH 1 \
  CONFIG.C_PROBE40_MU_CNT 1 \
  CONFIG.C_PROBE40_TYPE 0 \
  CONFIG.C_PROBE40_WIDTH 1 \
  CONFIG.C_PROBE41_MU_CNT 1 \
  CONFIG.C_PROBE41_TYPE 0 \
  CONFIG.C_PROBE41_WIDTH 1 \
  CONFIG.C_PROBE42_TYPE 0 \
  CONFIG.C_PROBE42_WIDTH 2 \
  CONFIG.C_PROBE43_TYPE 0 \
  CONFIG.C_PROBE43_WIDTH 32 \
  CONFIG.C_PROBE44_TYPE 0 \
  CONFIG.C_PROBE44_WIDTH 2 \
  CONFIG.C_PROBE45_TYPE 0 \
  CONFIG.C_PROBE45_WIDTH 4 \
  CONFIG.C_PROBE46_TYPE 0 \
  CONFIG.C_PROBE46_WIDTH 8 \
  CONFIG.C_PROBE47_TYPE 0 \
  CONFIG.C_PROBE47_WIDTH 3 \
  CONFIG.C_PROBE48_TYPE 0 \
  CONFIG.C_PROBE48_WIDTH 3 \
  CONFIG.C_PROBE49_TYPE 0 \
  CONFIG.C_PROBE49_WIDTH 2 \
  CONFIG.C_PROBE4_MU_CNT 1 \
  CONFIG.C_PROBE4_TYPE 0 \
  CONFIG.C_PROBE4_WIDTH 1 \
  CONFIG.C_PROBE50_TYPE 0 \
  CONFIG.C_PROBE50_WIDTH 32 \
  CONFIG.C_PROBE51_TYPE 0 \
  CONFIG.C_PROBE51_WIDTH 2 \
  CONFIG.C_PROBE52_TYPE 0 \
  CONFIG.C_PROBE52_WIDTH 4 \
  CONFIG.C_PROBE53_TYPE 0 \
  CONFIG.C_PROBE53_WIDTH 8 \
  CONFIG.C_PROBE54_TYPE 0 \
  CONFIG.C_PROBE54_WIDTH 3 \
  CONFIG.C_PROBE55_TYPE 0 \
  CONFIG.C_PROBE55_WIDTH 3 \
  CONFIG.C_PROBE56_TYPE 0 \
  CONFIG.C_PROBE56_WIDTH 2 \
  CONFIG.C_PROBE57_TYPE 0 \
  CONFIG.C_PROBE57_WIDTH 2 \
  CONFIG.C_PROBE58_TYPE 0 \
  CONFIG.C_PROBE58_WIDTH 2 \
  CONFIG.C_PROBE59_TYPE 0 \
  CONFIG.C_PROBE59_WIDTH 32 \
  CONFIG.C_PROBE5_MU_CNT 1 \
  CONFIG.C_PROBE5_TYPE 0 \
  CONFIG.C_PROBE5_WIDTH 1 \
  CONFIG.C_PROBE60_TYPE 0 \
  CONFIG.C_PROBE60_WIDTH 2 \
  CONFIG.C_PROBE61_TYPE 0 \
  CONFIG.C_PROBE61_WIDTH 32 \
  CONFIG.C_PROBE62_TYPE 0 \
  CONFIG.C_PROBE62_WIDTH 4 \
  CONFIG.C_PROBE63_TYPE 0 \
  CONFIG.C_PROBE63_WIDTH 2 \
  CONFIG.C_PROBE64_TYPE 0 \
  CONFIG.C_PROBE64_WIDTH 3 \
  CONFIG.C_PROBE65_TYPE 0 \
  CONFIG.C_PROBE65_WIDTH 2 \
  CONFIG.C_PROBE66_TYPE 0 \
  CONFIG.C_PROBE66_WIDTH 2 \
  CONFIG.C_PROBE67_TYPE 0 \
  CONFIG.C_PROBE67_WIDTH 3 \
  CONFIG.C_PROBE68_TYPE 0 \
  CONFIG.C_PROBE68_WIDTH 2 \
  CONFIG.C_PROBE69_TYPE 0 \
  CONFIG.C_PROBE69_WIDTH 32 \
  CONFIG.C_PROBE6_MU_CNT 1 \
  CONFIG.C_PROBE6_TYPE 0 \
  CONFIG.C_PROBE6_WIDTH 1 \
  CONFIG.C_PROBE70_TYPE 0 \
  CONFIG.C_PROBE70_WIDTH 2 \
  CONFIG.C_PROBE71_TYPE 0 \
  CONFIG.C_PROBE71_WIDTH 4 \
  CONFIG.C_PROBE72_TYPE 0 \
  CONFIG.C_PROBE72_WIDTH 8 \
  CONFIG.C_PROBE73_TYPE 0 \
  CONFIG.C_PROBE73_WIDTH 3 \
  CONFIG.C_PROBE74_TYPE 0 \
  CONFIG.C_PROBE74_WIDTH 3 \
  CONFIG.C_PROBE75_TYPE 0 \
  CONFIG.C_PROBE75_WIDTH 2 \
  CONFIG.C_PROBE76_TYPE 0 \
  CONFIG.C_PROBE76_WIDTH 32 \
  CONFIG.C_PROBE77_TYPE 0 \
  CONFIG.C_PROBE77_WIDTH 2 \
  CONFIG.C_PROBE78_TYPE 0 \
  CONFIG.C_PROBE78_WIDTH 4 \
  CONFIG.C_PROBE79_TYPE 0 \
  CONFIG.C_PROBE79_WIDTH 8 \
  CONFIG.C_PROBE7_MU_CNT 1 \
  CONFIG.C_PROBE7_TYPE 0 \
  CONFIG.C_PROBE7_WIDTH 1 \
  CONFIG.C_PROBE80_TYPE 0 \
  CONFIG.C_PROBE80_WIDTH 3 \
  CONFIG.C_PROBE81_TYPE 0 \
  CONFIG.C_PROBE81_WIDTH 3 \
  CONFIG.C_PROBE82_TYPE 0 \
  CONFIG.C_PROBE82_WIDTH 2 \
  CONFIG.C_PROBE83_TYPE 0 \
  CONFIG.C_PROBE83_WIDTH 2 \
  CONFIG.C_PROBE84_TYPE 0 \
  CONFIG.C_PROBE84_WIDTH 2 \
  CONFIG.C_PROBE85_TYPE 0 \
  CONFIG.C_PROBE85_WIDTH 32 \
  CONFIG.C_PROBE86_TYPE 0 \
  CONFIG.C_PROBE86_WIDTH 2 \
  CONFIG.C_PROBE87_TYPE 0 \
  CONFIG.C_PROBE87_WIDTH 32 \
  CONFIG.C_PROBE88_TYPE 0 \
  CONFIG.C_PROBE88_WIDTH 4 \
  CONFIG.C_PROBE89_TYPE 0 \
  CONFIG.C_PROBE89_WIDTH 2 \
  CONFIG.C_PROBE8_MU_CNT 1 \
  CONFIG.C_PROBE8_TYPE 0 \
  CONFIG.C_PROBE8_WIDTH 1 \
  CONFIG.C_PROBE90_TYPE 0 \
  CONFIG.C_PROBE90_WIDTH 3 \
  CONFIG.C_PROBE91_TYPE 0 \
  CONFIG.C_PROBE91_WIDTH 2 \
  CONFIG.C_PROBE92_TYPE 0 \
  CONFIG.C_PROBE92_WIDTH 2 \
  CONFIG.C_PROBE93_TYPE 0 \
  CONFIG.C_PROBE93_WIDTH 3 \
  CONFIG.C_PROBE94_TYPE 0 \
  CONFIG.C_PROBE94_WIDTH 2 \
  CONFIG.C_PROBE95_TYPE 0 \
  CONFIG.C_PROBE95_WIDTH 32 \
  CONFIG.C_PROBE96_TYPE 0 \
  CONFIG.C_PROBE96_WIDTH 2 \
  CONFIG.C_PROBE97_TYPE 0 \
  CONFIG.C_PROBE97_WIDTH 4 \
  CONFIG.C_PROBE98_TYPE 0 \
  CONFIG.C_PROBE98_WIDTH 8 \
  CONFIG.C_PROBE99_TYPE 0 \
  CONFIG.C_PROBE99_WIDTH 3 \
  CONFIG.C_PROBE9_MU_CNT 1 \
  CONFIG.C_PROBE9_TYPE 0 \
  CONFIG.C_PROBE9_WIDTH 1 \
  CONFIG.C_TIME_TAG_WIDTH 32 \
  CONFIG.C_TRIGIN_EN false \
  CONFIG.C_TRIGOUT_EN false \
  CONFIG.C_XLNX_HW_PROBE_INFO DEFAULT \
] [get_bd_cells ila_lib]
create_bd_cell -type ip -vlnv xilinx.com:ip:gigantic_mux:1.0 g_inst
set_property -dict [list \
  CONFIG.C_EN_GIGAMUX false \
  CONFIG.C_NUM_MONITOR_SLOTS 12 \
  CONFIG.C_NUM_OF_PROBES 0 \
  CONFIG.C_SLOT_0_AXI_ADDR_WIDTH 32 \
  CONFIG.C_SLOT_0_AXI_ARUSER_WIDTH 0 \
  CONFIG.C_SLOT_0_AXI_AR_SEL 1 \
  CONFIG.C_SLOT_0_AXI_AWUSER_WIDTH 0 \
  CONFIG.C_SLOT_0_AXI_AW_SEL 1 \
  CONFIG.C_SLOT_0_AXI_AXLEN_WIDTH 8 \
  CONFIG.C_SLOT_0_AXI_AXLOCK_WIDTH 1 \
  CONFIG.C_SLOT_0_AXI_BUSER_WIDTH 0 \
  CONFIG.C_SLOT_0_AXI_B_SEL 1 \
  CONFIG.C_SLOT_0_AXI_DATA_WIDTH 32 \
  CONFIG.C_SLOT_0_AXI_ID_WIDTH 0 \
  CONFIG.C_SLOT_0_AXI_PROTOCOL AXI4 \
  CONFIG.C_SLOT_0_AXI_RUSER_WIDTH 0 \
  CONFIG.C_SLOT_0_AXI_R_SEL 1 \
  CONFIG.C_SLOT_0_AXI_WUSER_WIDTH 0 \
  CONFIG.C_SLOT_0_AXI_W_SEL 1 \
  CONFIG.C_SLOT_0_HAS_BRESP 1 \
  CONFIG.C_SLOT_0_HAS_BURST 1 \
  CONFIG.C_SLOT_0_HAS_CACHE 1 \
  CONFIG.C_SLOT_0_HAS_LOCK 0 \
  CONFIG.C_SLOT_0_HAS_PROT 1 \
  CONFIG.C_SLOT_0_HAS_QOS 0 \
  CONFIG.C_SLOT_0_HAS_REGION 0 \
  CONFIG.C_SLOT_0_HAS_RRESP 1 \
  CONFIG.C_SLOT_0_HAS_WSTRB 1 \
  CONFIG.C_SLOT_0_MAX_RD_BURSTS 1 \
  CONFIG.C_SLOT_0_MAX_WR_BURSTS 1 \
  CONFIG.C_SLOT_0_MON_MODE FT \
  CONFIG.C_SLOT_0_TXN_CNTR_EN 1 \
  CONFIG.C_SLOT_10_AXI_ADDR_WIDTH 32 \
  CONFIG.C_SLOT_10_AXI_ARUSER_WIDTH 0 \
  CONFIG.C_SLOT_10_AXI_AR_SEL 1 \
  CONFIG.C_SLOT_10_AXI_AWUSER_WIDTH 0 \
  CONFIG.C_SLOT_10_AXI_AW_SEL 1 \
  CONFIG.C_SLOT_10_AXI_AXLEN_WIDTH 4 \
  CONFIG.C_SLOT_10_AXI_AXLOCK_WIDTH 2 \
  CONFIG.C_SLOT_10_AXI_BUSER_WIDTH 0 \
  CONFIG.C_SLOT_10_AXI_B_SEL 1 \
  CONFIG.C_SLOT_10_AXI_DATA_WIDTH 32 \
  CONFIG.C_SLOT_10_AXI_ID_WIDTH 0 \
  CONFIG.C_SLOT_10_AXI_PROTOCOL AXI3 \
  CONFIG.C_SLOT_10_AXI_RUSER_WIDTH 0 \
  CONFIG.C_SLOT_10_AXI_R_SEL 1 \
  CONFIG.C_SLOT_10_AXI_WUSER_WIDTH 0 \
  CONFIG.C_SLOT_10_AXI_W_SEL 1 \
  CONFIG.C_SLOT_10_HAS_BRESP 1 \
  CONFIG.C_SLOT_10_HAS_BURST 1 \
  CONFIG.C_SLOT_10_HAS_CACHE 1 \
  CONFIG.C_SLOT_10_HAS_LOCK 0 \
  CONFIG.C_SLOT_10_HAS_PROT 1 \
  CONFIG.C_SLOT_10_HAS_QOS 0 \
  CONFIG.C_SLOT_10_HAS_REGION 0 \
  CONFIG.C_SLOT_10_HAS_RRESP 1 \
  CONFIG.C_SLOT_10_HAS_WSTRB 1 \
  CONFIG.C_SLOT_10_MAX_RD_BURSTS 1 \
  CONFIG.C_SLOT_10_MAX_WR_BURSTS 1 \
  CONFIG.C_SLOT_10_MON_MODE FT \
  CONFIG.C_SLOT_10_TXN_CNTR_EN 1 \
  CONFIG.C_SLOT_11_AXI_ADDR_WIDTH 32 \
  CONFIG.C_SLOT_11_AXI_ARUSER_WIDTH 0 \
  CONFIG.C_SLOT_11_AXI_AR_SEL 1 \
  CONFIG.C_SLOT_11_AXI_AWUSER_WIDTH 0 \
  CONFIG.C_SLOT_11_AXI_AW_SEL 1 \
  CONFIG.C_SLOT_11_AXI_AXLEN_WIDTH 4 \
  CONFIG.C_SLOT_11_AXI_AXLOCK_WIDTH 2 \
  CONFIG.C_SLOT_11_AXI_BUSER_WIDTH 0 \
  CONFIG.C_SLOT_11_AXI_B_SEL 1 \
  CONFIG.C_SLOT_11_AXI_DATA_WIDTH 32 \
  CONFIG.C_SLOT_11_AXI_ID_WIDTH 0 \
  CONFIG.C_SLOT_11_AXI_PROTOCOL AXI3 \
  CONFIG.C_SLOT_11_AXI_RUSER_WIDTH 0 \
  CONFIG.C_SLOT_11_AXI_R_SEL 1 \
  CONFIG.C_SLOT_11_AXI_WUSER_WIDTH 0 \
  CONFIG.C_SLOT_11_AXI_W_SEL 1 \
  CONFIG.C_SLOT_11_HAS_BRESP 1 \
  CONFIG.C_SLOT_11_HAS_BURST 1 \
  CONFIG.C_SLOT_11_HAS_CACHE 1 \
  CONFIG.C_SLOT_11_HAS_LOCK 0 \
  CONFIG.C_SLOT_11_HAS_PROT 1 \
  CONFIG.C_SLOT_11_HAS_QOS 0 \
  CONFIG.C_SLOT_11_HAS_REGION 0 \
  CONFIG.C_SLOT_11_HAS_RRESP 1 \
  CONFIG.C_SLOT_11_HAS_WSTRB 1 \
  CONFIG.C_SLOT_11_MAX_RD_BURSTS 1 \
  CONFIG.C_SLOT_11_MAX_WR_BURSTS 1 \
  CONFIG.C_SLOT_11_MON_MODE FT \
  CONFIG.C_SLOT_11_TXN_CNTR_EN 1 \
  CONFIG.C_SLOT_1_AXI_ADDR_WIDTH 32 \
  CONFIG.C_SLOT_1_AXI_ARUSER_WIDTH 0 \
  CONFIG.C_SLOT_1_AXI_AR_SEL 1 \
  CONFIG.C_SLOT_1_AXI_AWUSER_WIDTH 0 \
  CONFIG.C_SLOT_1_AXI_AW_SEL 1 \
  CONFIG.C_SLOT_1_AXI_AXLEN_WIDTH 8 \
  CONFIG.C_SLOT_1_AXI_AXLOCK_WIDTH 1 \
  CONFIG.C_SLOT_1_AXI_BUSER_WIDTH 0 \
  CONFIG.C_SLOT_1_AXI_B_SEL 1 \
  CONFIG.C_SLOT_1_AXI_DATA_WIDTH 32 \
  CONFIG.C_SLOT_1_AXI_ID_WIDTH 0 \
  CONFIG.C_SLOT_1_AXI_PROTOCOL AXI4 \
  CONFIG.C_SLOT_1_AXI_RUSER_WIDTH 0 \
  CONFIG.C_SLOT_1_AXI_R_SEL 1 \
  CONFIG.C_SLOT_1_AXI_WUSER_WIDTH 0 \
  CONFIG.C_SLOT_1_AXI_W_SEL 1 \
  CONFIG.C_SLOT_1_HAS_BRESP 1 \
  CONFIG.C_SLOT_1_HAS_BURST 1 \
  CONFIG.C_SLOT_1_HAS_CACHE 1 \
  CONFIG.C_SLOT_1_HAS_LOCK 0 \
  CONFIG.C_SLOT_1_HAS_PROT 1 \
  CONFIG.C_SLOT_1_HAS_QOS 0 \
  CONFIG.C_SLOT_1_HAS_REGION 0 \
  CONFIG.C_SLOT_1_HAS_RRESP 1 \
  CONFIG.C_SLOT_1_HAS_WSTRB 1 \
  CONFIG.C_SLOT_1_MAX_RD_BURSTS 1 \
  CONFIG.C_SLOT_1_MAX_WR_BURSTS 1 \
  CONFIG.C_SLOT_1_MON_MODE FT \
  CONFIG.C_SLOT_1_TXN_CNTR_EN 1 \
  CONFIG.C_SLOT_2_AXI_ADDR_WIDTH 32 \
  CONFIG.C_SLOT_2_AXI_ARUSER_WIDTH 0 \
  CONFIG.C_SLOT_2_AXI_AR_SEL 1 \
  CONFIG.C_SLOT_2_AXI_AWUSER_WIDTH 0 \
  CONFIG.C_SLOT_2_AXI_AW_SEL 1 \
  CONFIG.C_SLOT_2_AXI_AXLEN_WIDTH 8 \
  CONFIG.C_SLOT_2_AXI_AXLOCK_WIDTH 1 \
  CONFIG.C_SLOT_2_AXI_BUSER_WIDTH 0 \
  CONFIG.C_SLOT_2_AXI_B_SEL 1 \
  CONFIG.C_SLOT_2_AXI_DATA_WIDTH 32 \
  CONFIG.C_SLOT_2_AXI_ID_WIDTH 0 \
  CONFIG.C_SLOT_2_AXI_PROTOCOL AXI4 \
  CONFIG.C_SLOT_2_AXI_RUSER_WIDTH 0 \
  CONFIG.C_SLOT_2_AXI_R_SEL 1 \
  CONFIG.C_SLOT_2_AXI_WUSER_WIDTH 0 \
  CONFIG.C_SLOT_2_AXI_W_SEL 1 \
  CONFIG.C_SLOT_2_HAS_BRESP 1 \
  CONFIG.C_SLOT_2_HAS_BURST 1 \
  CONFIG.C_SLOT_2_HAS_CACHE 1 \
  CONFIG.C_SLOT_2_HAS_LOCK 0 \
  CONFIG.C_SLOT_2_HAS_PROT 1 \
  CONFIG.C_SLOT_2_HAS_QOS 0 \
  CONFIG.C_SLOT_2_HAS_REGION 0 \
  CONFIG.C_SLOT_2_HAS_RRESP 1 \
  CONFIG.C_SLOT_2_HAS_WSTRB 1 \
  CONFIG.C_SLOT_2_MAX_RD_BURSTS 1 \
  CONFIG.C_SLOT_2_MAX_WR_BURSTS 1 \
  CONFIG.C_SLOT_2_MON_MODE FT \
  CONFIG.C_SLOT_2_TXN_CNTR_EN 1 \
  CONFIG.C_SLOT_3_AXI_ADDR_WIDTH 32 \
  CONFIG.C_SLOT_3_AXI_ARUSER_WIDTH 0 \
  CONFIG.C_SLOT_3_AXI_AR_SEL 1 \
  CONFIG.C_SLOT_3_AXI_AWUSER_WIDTH 0 \
  CONFIG.C_SLOT_3_AXI_AW_SEL 1 \
  CONFIG.C_SLOT_3_AXI_AXLEN_WIDTH 8 \
  CONFIG.C_SLOT_3_AXI_AXLOCK_WIDTH 1 \
  CONFIG.C_SLOT_3_AXI_BUSER_WIDTH 0 \
  CONFIG.C_SLOT_3_AXI_B_SEL 1 \
  CONFIG.C_SLOT_3_AXI_DATA_WIDTH 32 \
  CONFIG.C_SLOT_3_AXI_ID_WIDTH 0 \
  CONFIG.C_SLOT_3_AXI_PROTOCOL AXI4 \
  CONFIG.C_SLOT_3_AXI_RUSER_WIDTH 0 \
  CONFIG.C_SLOT_3_AXI_R_SEL 1 \
  CONFIG.C_SLOT_3_AXI_WUSER_WIDTH 0 \
  CONFIG.C_SLOT_3_AXI_W_SEL 1 \
  CONFIG.C_SLOT_3_HAS_BRESP 1 \
  CONFIG.C_SLOT_3_HAS_BURST 1 \
  CONFIG.C_SLOT_3_HAS_CACHE 1 \
  CONFIG.C_SLOT_3_HAS_LOCK 0 \
  CONFIG.C_SLOT_3_HAS_PROT 1 \
  CONFIG.C_SLOT_3_HAS_QOS 0 \
  CONFIG.C_SLOT_3_HAS_REGION 0 \
  CONFIG.C_SLOT_3_HAS_RRESP 1 \
  CONFIG.C_SLOT_3_HAS_WSTRB 1 \
  CONFIG.C_SLOT_3_MAX_RD_BURSTS 1 \
  CONFIG.C_SLOT_3_MAX_WR_BURSTS 1 \
  CONFIG.C_SLOT_3_MON_MODE FT \
  CONFIG.C_SLOT_3_TXN_CNTR_EN 1 \
  CONFIG.C_SLOT_4_AXI_ADDR_WIDTH 32 \
  CONFIG.C_SLOT_4_AXI_ARUSER_WIDTH 0 \
  CONFIG.C_SLOT_4_AXI_AR_SEL 1 \
  CONFIG.C_SLOT_4_AXI_AWUSER_WIDTH 0 \
  CONFIG.C_SLOT_4_AXI_AW_SEL 1 \
  CONFIG.C_SLOT_4_AXI_AXLEN_WIDTH 8 \
  CONFIG.C_SLOT_4_AXI_AXLOCK_WIDTH 1 \
  CONFIG.C_SLOT_4_AXI_BUSER_WIDTH 0 \
  CONFIG.C_SLOT_4_AXI_B_SEL 1 \
  CONFIG.C_SLOT_4_AXI_DATA_WIDTH 32 \
  CONFIG.C_SLOT_4_AXI_ID_WIDTH 0 \
  CONFIG.C_SLOT_4_AXI_PROTOCOL AXI4 \
  CONFIG.C_SLOT_4_AXI_RUSER_WIDTH 0 \
  CONFIG.C_SLOT_4_AXI_R_SEL 1 \
  CONFIG.C_SLOT_4_AXI_WUSER_WIDTH 0 \
  CONFIG.C_SLOT_4_AXI_W_SEL 1 \
  CONFIG.C_SLOT_4_HAS_BRESP 1 \
  CONFIG.C_SLOT_4_HAS_BURST 1 \
  CONFIG.C_SLOT_4_HAS_CACHE 1 \
  CONFIG.C_SLOT_4_HAS_LOCK 0 \
  CONFIG.C_SLOT_4_HAS_PROT 1 \
  CONFIG.C_SLOT_4_HAS_QOS 0 \
  CONFIG.C_SLOT_4_HAS_REGION 0 \
  CONFIG.C_SLOT_4_HAS_RRESP 1 \
  CONFIG.C_SLOT_4_HAS_WSTRB 1 \
  CONFIG.C_SLOT_4_MAX_RD_BURSTS 1 \
  CONFIG.C_SLOT_4_MAX_WR_BURSTS 1 \
  CONFIG.C_SLOT_4_MON_MODE FT \
  CONFIG.C_SLOT_4_TXN_CNTR_EN 1 \
  CONFIG.C_SLOT_5_AXI_ADDR_WIDTH 32 \
  CONFIG.C_SLOT_5_AXI_ARUSER_WIDTH 0 \
  CONFIG.C_SLOT_5_AXI_AR_SEL 1 \
  CONFIG.C_SLOT_5_AXI_AWUSER_WIDTH 0 \
  CONFIG.C_SLOT_5_AXI_AW_SEL 1 \
  CONFIG.C_SLOT_5_AXI_AXLEN_WIDTH 8 \
  CONFIG.C_SLOT_5_AXI_AXLOCK_WIDTH 1 \
  CONFIG.C_SLOT_5_AXI_BUSER_WIDTH 0 \
  CONFIG.C_SLOT_5_AXI_B_SEL 1 \
  CONFIG.C_SLOT_5_AXI_DATA_WIDTH 32 \
  CONFIG.C_SLOT_5_AXI_ID_WIDTH 0 \
  CONFIG.C_SLOT_5_AXI_PROTOCOL AXI4 \
  CONFIG.C_SLOT_5_AXI_RUSER_WIDTH 0 \
  CONFIG.C_SLOT_5_AXI_R_SEL 1 \
  CONFIG.C_SLOT_5_AXI_WUSER_WIDTH 0 \
  CONFIG.C_SLOT_5_AXI_W_SEL 1 \
  CONFIG.C_SLOT_5_HAS_BRESP 1 \
  CONFIG.C_SLOT_5_HAS_BURST 1 \
  CONFIG.C_SLOT_5_HAS_CACHE 1 \
  CONFIG.C_SLOT_5_HAS_LOCK 0 \
  CONFIG.C_SLOT_5_HAS_PROT 1 \
  CONFIG.C_SLOT_5_HAS_QOS 0 \
  CONFIG.C_SLOT_5_HAS_REGION 0 \
  CONFIG.C_SLOT_5_HAS_RRESP 1 \
  CONFIG.C_SLOT_5_HAS_WSTRB 1 \
  CONFIG.C_SLOT_5_MAX_RD_BURSTS 1 \
  CONFIG.C_SLOT_5_MAX_WR_BURSTS 1 \
  CONFIG.C_SLOT_5_MON_MODE FT \
  CONFIG.C_SLOT_5_TXN_CNTR_EN 1 \
  CONFIG.C_SLOT_6_AXI_ADDR_WIDTH 32 \
  CONFIG.C_SLOT_6_AXI_ARUSER_WIDTH 0 \
  CONFIG.C_SLOT_6_AXI_AR_SEL 1 \
  CONFIG.C_SLOT_6_AXI_AWUSER_WIDTH 0 \
  CONFIG.C_SLOT_6_AXI_AW_SEL 1 \
  CONFIG.C_SLOT_6_AXI_AXLEN_WIDTH 4 \
  CONFIG.C_SLOT_6_AXI_AXLOCK_WIDTH 2 \
  CONFIG.C_SLOT_6_AXI_BUSER_WIDTH 0 \
  CONFIG.C_SLOT_6_AXI_B_SEL 1 \
  CONFIG.C_SLOT_6_AXI_DATA_WIDTH 32 \
  CONFIG.C_SLOT_6_AXI_ID_WIDTH 0 \
  CONFIG.C_SLOT_6_AXI_PROTOCOL AXI3 \
  CONFIG.C_SLOT_6_AXI_RUSER_WIDTH 0 \
  CONFIG.C_SLOT_6_AXI_R_SEL 1 \
  CONFIG.C_SLOT_6_AXI_WUSER_WIDTH 0 \
  CONFIG.C_SLOT_6_AXI_W_SEL 1 \
  CONFIG.C_SLOT_6_HAS_BRESP 1 \
  CONFIG.C_SLOT_6_HAS_BURST 1 \
  CONFIG.C_SLOT_6_HAS_CACHE 1 \
  CONFIG.C_SLOT_6_HAS_LOCK 0 \
  CONFIG.C_SLOT_6_HAS_PROT 1 \
  CONFIG.C_SLOT_6_HAS_QOS 0 \
  CONFIG.C_SLOT_6_HAS_REGION 0 \
  CONFIG.C_SLOT_6_HAS_RRESP 1 \
  CONFIG.C_SLOT_6_HAS_WSTRB 1 \
  CONFIG.C_SLOT_6_MAX_RD_BURSTS 1 \
  CONFIG.C_SLOT_6_MAX_WR_BURSTS 1 \
  CONFIG.C_SLOT_6_MON_MODE FT \
  CONFIG.C_SLOT_6_TXN_CNTR_EN 1 \
  CONFIG.C_SLOT_7_AXI_ADDR_WIDTH 32 \
  CONFIG.C_SLOT_7_AXI_ARUSER_WIDTH 0 \
  CONFIG.C_SLOT_7_AXI_AR_SEL 1 \
  CONFIG.C_SLOT_7_AXI_AWUSER_WIDTH 0 \
  CONFIG.C_SLOT_7_AXI_AW_SEL 1 \
  CONFIG.C_SLOT_7_AXI_AXLEN_WIDTH 4 \
  CONFIG.C_SLOT_7_AXI_AXLOCK_WIDTH 2 \
  CONFIG.C_SLOT_7_AXI_BUSER_WIDTH 0 \
  CONFIG.C_SLOT_7_AXI_B_SEL 1 \
  CONFIG.C_SLOT_7_AXI_DATA_WIDTH 32 \
  CONFIG.C_SLOT_7_AXI_ID_WIDTH 0 \
  CONFIG.C_SLOT_7_AXI_PROTOCOL AXI3 \
  CONFIG.C_SLOT_7_AXI_RUSER_WIDTH 0 \
  CONFIG.C_SLOT_7_AXI_R_SEL 1 \
  CONFIG.C_SLOT_7_AXI_WUSER_WIDTH 0 \
  CONFIG.C_SLOT_7_AXI_W_SEL 1 \
  CONFIG.C_SLOT_7_HAS_BRESP 1 \
  CONFIG.C_SLOT_7_HAS_BURST 1 \
  CONFIG.C_SLOT_7_HAS_CACHE 1 \
  CONFIG.C_SLOT_7_HAS_LOCK 0 \
  CONFIG.C_SLOT_7_HAS_PROT 1 \
  CONFIG.C_SLOT_7_HAS_QOS 0 \
  CONFIG.C_SLOT_7_HAS_REGION 0 \
  CONFIG.C_SLOT_7_HAS_RRESP 1 \
  CONFIG.C_SLOT_7_HAS_WSTRB 1 \
  CONFIG.C_SLOT_7_MAX_RD_BURSTS 1 \
  CONFIG.C_SLOT_7_MAX_WR_BURSTS 1 \
  CONFIG.C_SLOT_7_MON_MODE FT \
  CONFIG.C_SLOT_7_TXN_CNTR_EN 1 \
  CONFIG.C_SLOT_8_AXI_ADDR_WIDTH 32 \
  CONFIG.C_SLOT_8_AXI_ARUSER_WIDTH 0 \
  CONFIG.C_SLOT_8_AXI_AR_SEL 1 \
  CONFIG.C_SLOT_8_AXI_AWUSER_WIDTH 0 \
  CONFIG.C_SLOT_8_AXI_AW_SEL 1 \
  CONFIG.C_SLOT_8_AXI_AXLEN_WIDTH 4 \
  CONFIG.C_SLOT_8_AXI_AXLOCK_WIDTH 2 \
  CONFIG.C_SLOT_8_AXI_BUSER_WIDTH 0 \
  CONFIG.C_SLOT_8_AXI_B_SEL 1 \
  CONFIG.C_SLOT_8_AXI_DATA_WIDTH 32 \
  CONFIG.C_SLOT_8_AXI_ID_WIDTH 0 \
  CONFIG.C_SLOT_8_AXI_PROTOCOL AXI3 \
  CONFIG.C_SLOT_8_AXI_RUSER_WIDTH 0 \
  CONFIG.C_SLOT_8_AXI_R_SEL 1 \
  CONFIG.C_SLOT_8_AXI_WUSER_WIDTH 0 \
  CONFIG.C_SLOT_8_AXI_W_SEL 1 \
  CONFIG.C_SLOT_8_HAS_BRESP 1 \
  CONFIG.C_SLOT_8_HAS_BURST 1 \
  CONFIG.C_SLOT_8_HAS_CACHE 1 \
  CONFIG.C_SLOT_8_HAS_LOCK 0 \
  CONFIG.C_SLOT_8_HAS_PROT 1 \
  CONFIG.C_SLOT_8_HAS_QOS 0 \
  CONFIG.C_SLOT_8_HAS_REGION 0 \
  CONFIG.C_SLOT_8_HAS_RRESP 1 \
  CONFIG.C_SLOT_8_HAS_WSTRB 1 \
  CONFIG.C_SLOT_8_MAX_RD_BURSTS 1 \
  CONFIG.C_SLOT_8_MAX_WR_BURSTS 1 \
  CONFIG.C_SLOT_8_MON_MODE FT \
  CONFIG.C_SLOT_8_TXN_CNTR_EN 1 \
  CONFIG.C_SLOT_9_AXI_ADDR_WIDTH 32 \
  CONFIG.C_SLOT_9_AXI_ARUSER_WIDTH 0 \
  CONFIG.C_SLOT_9_AXI_AR_SEL 1 \
  CONFIG.C_SLOT_9_AXI_AWUSER_WIDTH 0 \
  CONFIG.C_SLOT_9_AXI_AW_SEL 1 \
  CONFIG.C_SLOT_9_AXI_AXLEN_WIDTH 4 \
  CONFIG.C_SLOT_9_AXI_AXLOCK_WIDTH 2 \
  CONFIG.C_SLOT_9_AXI_BUSER_WIDTH 0 \
  CONFIG.C_SLOT_9_AXI_B_SEL 1 \
  CONFIG.C_SLOT_9_AXI_DATA_WIDTH 32 \
  CONFIG.C_SLOT_9_AXI_ID_WIDTH 0 \
  CONFIG.C_SLOT_9_AXI_PROTOCOL AXI3 \
  CONFIG.C_SLOT_9_AXI_RUSER_WIDTH 0 \
  CONFIG.C_SLOT_9_AXI_R_SEL 1 \
  CONFIG.C_SLOT_9_AXI_WUSER_WIDTH 0 \
  CONFIG.C_SLOT_9_AXI_W_SEL 1 \
  CONFIG.C_SLOT_9_HAS_BRESP 1 \
  CONFIG.C_SLOT_9_HAS_BURST 1 \
  CONFIG.C_SLOT_9_HAS_CACHE 1 \
  CONFIG.C_SLOT_9_HAS_LOCK 0 \
  CONFIG.C_SLOT_9_HAS_PROT 1 \
  CONFIG.C_SLOT_9_HAS_QOS 0 \
  CONFIG.C_SLOT_9_HAS_REGION 0 \
  CONFIG.C_SLOT_9_HAS_RRESP 1 \
  CONFIG.C_SLOT_9_HAS_WSTRB 1 \
  CONFIG.C_SLOT_9_MAX_RD_BURSTS 1 \
  CONFIG.C_SLOT_9_MAX_WR_BURSTS 1 \
  CONFIG.C_SLOT_9_MON_MODE FT \
  CONFIG.C_SLOT_9_TXN_CNTR_EN 1 \
] [get_bd_cells g_inst]
create_bd_cell -type ip -vlnv xilinx.com:ip:xlconcat:2.1 slot_0_aw
create_bd_cell -type ip -vlnv xilinx.com:ip:xlconcat:2.1 slot_0_w
set_property -dict {CONFIG.NUM_PORTS 3} [get_bd_cells slot_0_w]
create_bd_cell -type ip -vlnv xilinx.com:ip:xlconcat:2.1 slot_0_b
create_bd_cell -type ip -vlnv xilinx.com:ip:xlconcat:2.1 slot_0_ar
create_bd_cell -type ip -vlnv xilinx.com:ip:xlconcat:2.1 slot_0_r
set_property -dict {CONFIG.NUM_PORTS 3} [get_bd_cells slot_0_r]
create_bd_cell -type ip -vlnv xilinx.com:ip:xlconcat:2.1 slot_1_aw
create_bd_cell -type ip -vlnv xilinx.com:ip:xlconcat:2.1 slot_1_w
set_property -dict {CONFIG.NUM_PORTS 3} [get_bd_cells slot_1_w]
create_bd_cell -type ip -vlnv xilinx.com:ip:xlconcat:2.1 slot_1_b
create_bd_cell -type ip -vlnv xilinx.com:ip:xlconcat:2.1 slot_1_ar
create_bd_cell -type ip -vlnv xilinx.com:ip:xlconcat:2.1 slot_1_r
set_property -dict {CONFIG.NUM_PORTS 3} [get_bd_cells slot_1_r]
create_bd_cell -type ip -vlnv xilinx.com:ip:xlconcat:2.1 slot_2_aw
create_bd_cell -type ip -vlnv xilinx.com:ip:xlconcat:2.1 slot_2_w
set_property -dict {CONFIG.NUM_PORTS 3} [get_bd_cells slot_2_w]
create_bd_cell -type ip -vlnv xilinx.com:ip:xlconcat:2.1 slot_2_b
create_bd_cell -type ip -vlnv xilinx.com:ip:xlconcat:2.1 slot_2_ar
create_bd_cell -type ip -vlnv xilinx.com:ip:xlconcat:2.1 slot_2_r
set_property -dict {CONFIG.NUM_PORTS 3} [get_bd_cells slot_2_r]
create_bd_cell -type ip -vlnv xilinx.com:ip:xlconcat:2.1 slot_3_aw
create_bd_cell -type ip -vlnv xilinx.com:ip:xlconcat:2.1 slot_3_w
set_property -dict {CONFIG.NUM_PORTS 3} [get_bd_cells slot_3_w]
create_bd_cell -type ip -vlnv xilinx.com:ip:xlconcat:2.1 slot_3_b
create_bd_cell -type ip -vlnv xilinx.com:ip:xlconcat:2.1 slot_3_ar
create_bd_cell -type ip -vlnv xilinx.com:ip:xlconcat:2.1 slot_3_r
set_property -dict {CONFIG.NUM_PORTS 3} [get_bd_cells slot_3_r]
create_bd_cell -type ip -vlnv xilinx.com:ip:xlconcat:2.1 slot_4_aw
create_bd_cell -type ip -vlnv xilinx.com:ip:xlconcat:2.1 slot_4_w
set_property -dict {CONFIG.NUM_PORTS 3} [get_bd_cells slot_4_w]
create_bd_cell -type ip -vlnv xilinx.com:ip:xlconcat:2.1 slot_4_b
create_bd_cell -type ip -vlnv xilinx.com:ip:xlconcat:2.1 slot_4_ar
create_bd_cell -type ip -vlnv xilinx.com:ip:xlconcat:2.1 slot_4_r
set_property -dict {CONFIG.NUM_PORTS 3} [get_bd_cells slot_4_r]
create_bd_cell -type ip -vlnv xilinx.com:ip:xlconcat:2.1 slot_5_aw
create_bd_cell -type ip -vlnv xilinx.com:ip:xlconcat:2.1 slot_5_w
set_property -dict {CONFIG.NUM_PORTS 3} [get_bd_cells slot_5_w]
create_bd_cell -type ip -vlnv xilinx.com:ip:xlconcat:2.1 slot_5_b
create_bd_cell -type ip -vlnv xilinx.com:ip:xlconcat:2.1 slot_5_ar
create_bd_cell -type ip -vlnv xilinx.com:ip:xlconcat:2.1 slot_5_r
set_property -dict {CONFIG.NUM_PORTS 3} [get_bd_cells slot_5_r]
create_bd_cell -type ip -vlnv xilinx.com:ip:xlconcat:2.1 slot_6_aw
create_bd_cell -type ip -vlnv xilinx.com:ip:xlconcat:2.1 slot_6_w
set_property -dict {CONFIG.NUM_PORTS 3} [get_bd_cells slot_6_w]
create_bd_cell -type ip -vlnv xilinx.com:ip:xlconcat:2.1 slot_6_b
create_bd_cell -type ip -vlnv xilinx.com:ip:xlconcat:2.1 slot_6_ar
create_bd_cell -type ip -vlnv xilinx.com:ip:xlconcat:2.1 slot_6_r
set_property -dict {CONFIG.NUM_PORTS 3} [get_bd_cells slot_6_r]
create_bd_cell -type ip -vlnv xilinx.com:ip:xlconcat:2.1 slot_7_aw
create_bd_cell -type ip -vlnv xilinx.com:ip:xlconcat:2.1 slot_7_w
set_property -dict {CONFIG.NUM_PORTS 3} [get_bd_cells slot_7_w]
create_bd_cell -type ip -vlnv xilinx.com:ip:xlconcat:2.1 slot_7_b
create_bd_cell -type ip -vlnv xilinx.com:ip:xlconcat:2.1 slot_7_ar
create_bd_cell -type ip -vlnv xilinx.com:ip:xlconcat:2.1 slot_7_r
set_property -dict {CONFIG.NUM_PORTS 3} [get_bd_cells slot_7_r]
create_bd_cell -type ip -vlnv xilinx.com:ip:xlconcat:2.1 slot_8_aw
create_bd_cell -type ip -vlnv xilinx.com:ip:xlconcat:2.1 slot_8_w
set_property -dict {CONFIG.NUM_PORTS 3} [get_bd_cells slot_8_w]
create_bd_cell -type ip -vlnv xilinx.com:ip:xlconcat:2.1 slot_8_b
create_bd_cell -type ip -vlnv xilinx.com:ip:xlconcat:2.1 slot_8_ar
create_bd_cell -type ip -vlnv xilinx.com:ip:xlconcat:2.1 slot_8_r
set_property -dict {CONFIG.NUM_PORTS 3} [get_bd_cells slot_8_r]
create_bd_cell -type ip -vlnv xilinx.com:ip:xlconcat:2.1 slot_9_aw
create_bd_cell -type ip -vlnv xilinx.com:ip:xlconcat:2.1 slot_9_w
set_property -dict {CONFIG.NUM_PORTS 3} [get_bd_cells slot_9_w]
create_bd_cell -type ip -vlnv xilinx.com:ip:xlconcat:2.1 slot_9_b
create_bd_cell -type ip -vlnv xilinx.com:ip:xlconcat:2.1 slot_9_ar
create_bd_cell -type ip -vlnv xilinx.com:ip:xlconcat:2.1 slot_9_r
set_property -dict {CONFIG.NUM_PORTS 3} [get_bd_cells slot_9_r]
create_bd_cell -type ip -vlnv xilinx.com:ip:xlconcat:2.1 slot_10_aw
create_bd_cell -type ip -vlnv xilinx.com:ip:xlconcat:2.1 slot_10_w
set_property -dict {CONFIG.NUM_PORTS 3} [get_bd_cells slot_10_w]
create_bd_cell -type ip -vlnv xilinx.com:ip:xlconcat:2.1 slot_10_b
create_bd_cell -type ip -vlnv xilinx.com:ip:xlconcat:2.1 slot_10_ar
create_bd_cell -type ip -vlnv xilinx.com:ip:xlconcat:2.1 slot_10_r
set_property -dict {CONFIG.NUM_PORTS 3} [get_bd_cells slot_10_r]
create_bd_cell -type ip -vlnv xilinx.com:ip:xlconcat:2.1 slot_11_aw
create_bd_cell -type ip -vlnv xilinx.com:ip:xlconcat:2.1 slot_11_w
set_property -dict {CONFIG.NUM_PORTS 3} [get_bd_cells slot_11_w]
create_bd_cell -type ip -vlnv xilinx.com:ip:xlconcat:2.1 slot_11_b
create_bd_cell -type ip -vlnv xilinx.com:ip:xlconcat:2.1 slot_11_ar
create_bd_cell -type ip -vlnv xilinx.com:ip:xlconcat:2.1 slot_11_r
set_property -dict {CONFIG.NUM_PORTS 3} [get_bd_cells slot_11_r]
